# Altium project STM32_EVAL_BOARD.PrjPcb (part 1 of 2)
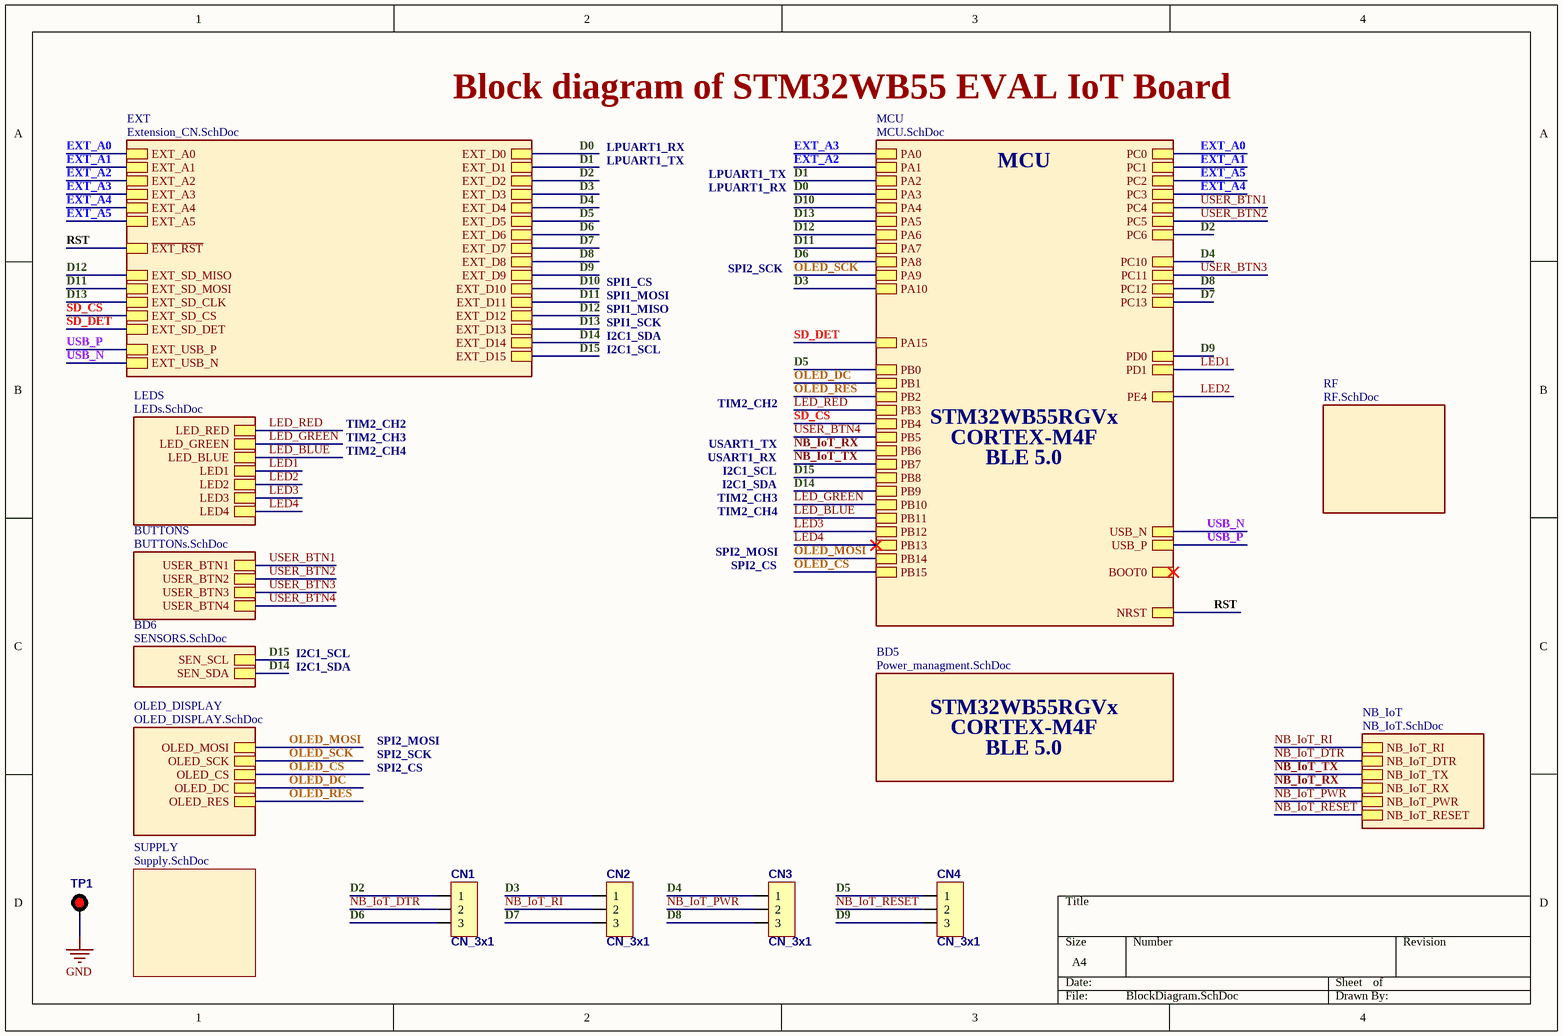
[diagram p0: BlockDiagram.SchDoc]
11 sheets, 201 parts. Net scope: hierarchical (ports join the sheet entries above them; power ports are global).
Board file: STM32WB_PCB.PcbDoc
Sheets:
  BlockDiagram.SchDoc
    EXT = Extension_CN.SchDoc
    MCU = MCU.SchDoc
    BUTTONS = BUTTONs.SchDoc
    BD5 = Power_managment.SchDoc
    NB_IoT = NB_IoT.SchDoc
    RF = RF.SchDoc
    LEDS = LEDs.SchDoc
    BD6 = SENSORS.SchDoc
    SUPPLY = Supply.SchDoc
    OLED_DISPLAY = OLED_DISPLAY.SchDoc

## Sheet BlockDiagram.SchDoc
size A4

### Parts
CN1  CN_3x1  [GP_3x1_2mm]
CN2  CN_3x1  [GP_3x1_2mm]
CN3  CN_3x1  [GP_3x1_2mm]
CN4  CN_3x1  [GP_3x1_2mm]
TP1  Keystone 5000 Test Point (RED)  [Keystone_5000_RED]  (value not drawn)

### Sub-sheets
BD5 = Power_managment.SchDoc: no entries
BD6 = SENSORS.SchDoc: SEN_SCL, SEN_SDA
BUTTONS = BUTTONs.SchDoc: USER_BTN2, USER_BTN3, USER_BTN1, USER_BTN4
EXT = Extension_CN.SchDoc: EXT_SD_CS, EXT_SD_MOSI, EXT_A5, EXT_A2, EXT_A4, EXT_A3, EXT_A1, EXT_A0, EXT_USB_P, EXT_SD_CLK, EXT_SD_MISO, EXT_SD_DET, EXT_USB_N, ~{EXT_RST}, EXT_D4, EXT_D3, EXT_D6, EXT_D0, EXT_D2, EXT_D5, EXT_D1, EXT_D7, EXT_D8, EXT_D10, EXT_D15, EXT_D12, EXT_D14, EXT_D13, EXT_D9, EXT_D11
LEDS = LEDs.SchDoc: LED_GREEN, LED2, LED_BLUE, LED1, LED_RED, LED3, LED4
MCU = MCU.SchDoc: PE4, PC4, PC0, PC3, USB_N, PC11, PC10, PC13, PC2, PC6, PC12, BOOT0, USB_P, PC5, PC1, NRST, PA10, PA9, PA8, PA7, PA6, PA5, PA3, PA1, PA2, PA0, PA4, PA15, PD0, PD1, PB0, PB1, PB15, PB14, PB13, PB12, PB11, PB9, PB8, PB7, PB6, PB5, PB2, PB4, PB10, PB3
NB_IoT = NB_IoT.SchDoc: NB_IoT_RI, NB_IoT_PWR, NB_IoT_RESET, NB_IoT_TX, NB_IoT_DTR, NB_IoT_RX
OLED_DISPLAY = OLED_DISPLAY.SchDoc: OLED_MOSI, OLED_SCK, OLED_CS, OLED_DC, OLED_RES
RF = RF.SchDoc: no entries
SUPPLY = Supply.SchDoc: no entries

### Nets
GND: TP1.0  [project net BS0]
D0: sheet EXT/EXT_D0, sheet MCU/PA3
D1: sheet EXT/EXT_D1, sheet MCU/PA2
D2: CN1.1 ; sheet EXT/EXT_D2, sheet MCU/PC6
D3: CN2.1 ; sheet EXT/EXT_D3, sheet MCU/PA10
D4: CN3.1 ; sheet EXT/EXT_D4, sheet MCU/PC10
D5: CN4.1 ; sheet EXT/EXT_D5, sheet MCU/PB0
D6: CN1.3 ; sheet EXT/EXT_D6, sheet MCU/PA8
D7: CN2.3 ; sheet EXT/EXT_D7, sheet MCU/PC13
D8: CN3.3 ; sheet EXT/EXT_D8, sheet MCU/PC12
D9: CN4.3 ; sheet EXT/EXT_D9, sheet MCU/PD0
D10: sheet EXT/EXT_D10, sheet MCU/PA4
D11: sheet EXT/EXT_SD_MOSI, sheet EXT/EXT_D11, sheet MCU/PA7
D12: sheet EXT/EXT_SD_MISO, sheet EXT/EXT_D12, sheet MCU/PA6
D13: sheet EXT/EXT_SD_CLK, sheet EXT/EXT_D13, sheet MCU/PA5
D14: sheet EXT/EXT_D14, sheet MCU/PB9, sheet BD6/SEN_SDA
D15: sheet EXT/EXT_D15, sheet MCU/PB8, sheet BD6/SEN_SCL
EXT_A0: sheet EXT/EXT_A0, sheet MCU/PC0  [project net A0]
EXT_A1: sheet EXT/EXT_A1, sheet MCU/PC1  [project net A1]
EXT_A2: sheet EXT/EXT_A2, sheet MCU/PA1  [project net A2]
EXT_A3: sheet EXT/EXT_A3, sheet MCU/PA0  [project net A3]
EXT_A4: sheet EXT/EXT_A4, sheet MCU/PC3
EXT_A5: sheet EXT/EXT_A5, sheet MCU/PC2
LED1: sheet MCU/PD1, sheet LEDS/LED1
LED2: sheet MCU/PE4, sheet LEDS/LED2
LED3: sheet MCU/PB12, sheet LEDS/LED3
LED4: sheet MCU/PB13, sheet LEDS/LED4
LED_BLUE: sheet MCU/PB11, sheet LEDS/LED_BLUE
LED_GREEN: sheet MCU/PB10, sheet LEDS/LED_GREEN
LED_RED: sheet MCU/PB3, sheet LEDS/LED_RED
NB_IoT_DTR: CN1.2 ; sheet NB_IoT/NB_IoT_DTR
NB_IoT_PWR: CN3.2 ; sheet NB_IoT/NB_IoT_PWR
NB_IoT_RESET: CN4.2 ; sheet NB_IoT/NB_IoT_RESET
NB_IoT_RI: CN2.2 ; sheet NB_IoT/NB_IoT_RI
NB_IoT_RX: sheet MCU/PB6, sheet NB_IoT/NB_IoT_RX
NB_IoT_TX: sheet MCU/PB7, sheet NB_IoT/NB_IoT_TX
OLED_CS: sheet MCU/PB15, sheet OLED_DISPLAY/OLED_CS  [project net CS]
OLED_DC: sheet MCU/PB1, sheet OLED_DISPLAY/OLED_DC  [project net D/C]
OLED_MOSI: sheet MCU/PB14, sheet OLED_DISPLAY/OLED_MOSI  [project net DIN]
OLED_RES: sheet MCU/PB2, sheet OLED_DISPLAY/OLED_RES
OLED_SCK: sheet MCU/PA9, sheet OLED_DISPLAY/OLED_SCK  [project net CLK]
RST: sheet EXT/~{EXT_RST}, sheet MCU/NRST
SD_CS: sheet EXT/EXT_SD_CS, sheet MCU/PB4
SD_DET: sheet EXT/EXT_SD_DET, sheet MCU/PA15
USB_N: sheet EXT/EXT_USB_N, sheet MCU/USB_N
USB_P: sheet EXT/EXT_USB_P, sheet MCU/USB_P
USER_BTN1: sheet MCU/PC4, sheet BUTTONS/USER_BTN1
USER_BTN2: sheet MCU/PC5, sheet BUTTONS/USER_BTN2
USER_BTN3: sheet MCU/PC11, sheet BUTTONS/USER_BTN3
USER_BTN4: sheet MCU/PB5, sheet BUTTONS/USER_BTN4

### Notes on the sheet
- Block diagram of STM32WB55 EVAL IoT Board
- LPUART1_RX
- LPUART1_TX
- MCU
- SPI1_MISO
- SPI1_MOSI
- SPI1_CS
- SPI2_SCK
- SPI1_SCK
- I2C1_SDA
- I2C1_SCL
- TIM2_CH4
- TIM2_CH3
- TIM2_CH2
- USART1_TX
- STM32WB55RGVx
- CORTEX-M4F
- USART1_RX
- BLE 5.0
- SPI2_MOSI
- SPI2_CS

### Library data of the parts
TP1 = Keystone 5000 Test Point

## Sheet Extension_CN.SchDoc: Arduino/Morphos extension connectors
size A4; Author: Ph.A; SheetNumber: 4; SheetTotal: 6
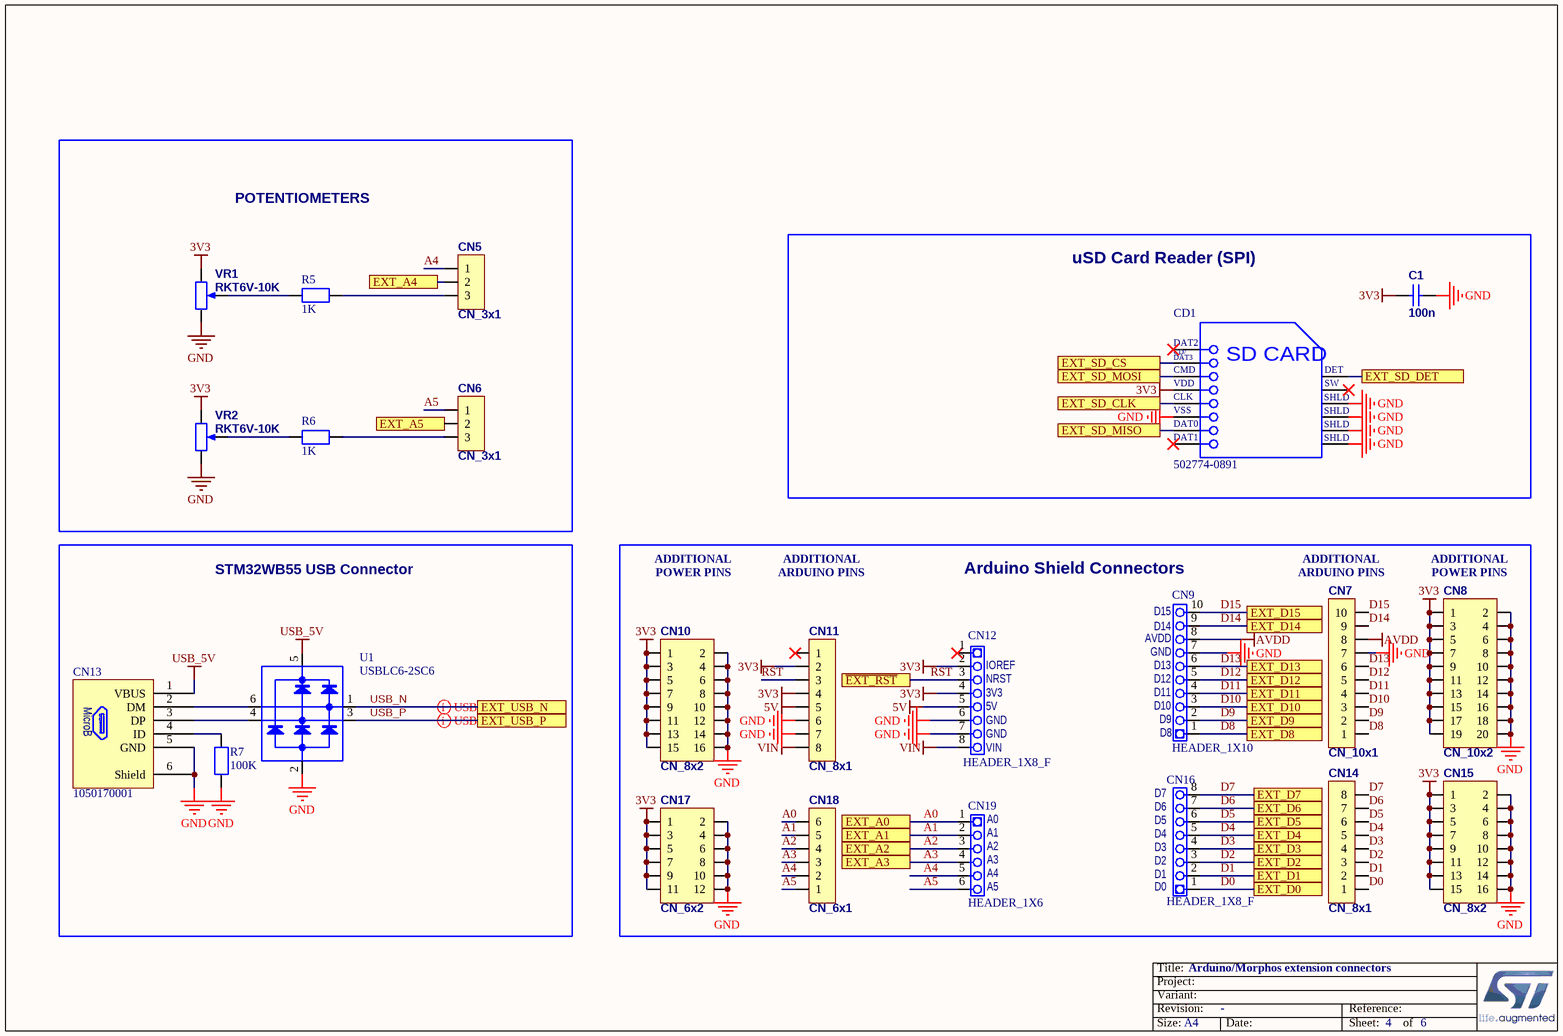
[diagram p1: Extension_CN.SchDoc]

### Parts
C1  100n  [0603_CAP_NPOL]
CD1  502774-0891  [MOLX-502774-0891_V]
CN5  CN_3x1  [GP_3x1_2mm]
CN6  CN_3x1  [GP_3x1_2mm]
CN7  CN_10x1  [GP_10x1]
CN8  CN_10x2  [GP_10x2]
CN9  HEADER_1X10  [Header F 1x10x2.54 TH V]
CN10  CN_8x2  [GP_8x2]
CN11  CN_8x1  [GP_8x1]
CN12  HEADER_1X8_F  [Header F 1x8x2.54 TH V]
CN13  1050170001  [USBMICROB_MOLEX_105017-0001_H2P90]
CN14  CN_8x1  [GP_8x1]
CN15  CN_8x2  [GP_8x2]
CN16  HEADER_1X8_F  [Header F 1x8x2.54 TH V]
CN17  CN_6x2  [GP_6x2]
CN18  CN_6x1  [GP_6x1]
CN19  HEADER_1X6  [Header F 1x6x2.54 TH V]
R5  1K  [0402_RES]
R6  1K  [0402_RES]
R7  100K  [0402_RES]
U1  USBLC6-2SC6  [SOT23-6]
VR1  RKT6V-10K  [PT6LV_2]
VR2  RKT6V-10K  [PT6LV_2]

### Blocks framed on the sheet
POTENTIOMETERS: CN5 CN6 R5 R6 VR1 VR2
uSD Card Reader (SPI): C1 CD1
STM32WB55 USB Connector: CN13 R7 U1
Arduino Shield Connectors: CN7-CN12 CN14-CN19

### Ports
EXT_A0, EXT_A1, EXT_A2, EXT_A3, EXT_A4, EXT_A5, EXT_D0, EXT_D1, EXT_D2, EXT_D3, EXT_D4, EXT_D5, EXT_D6, EXT_D7, EXT_D8, EXT_D9, EXT_D10, EXT_D11, EXT_D12, EXT_D13, EXT_D14, EXT_D15, EXT_SD_CLK, EXT_SD_CS, EXT_SD_DET, EXT_SD_MISO, EXT_SD_MOSI, EXT_USB_N, EXT_USB_P, ~{EXT_RST}

### Nets
3V3: C1.1 CD1.4(VDD) CN8.1 CN8.3 CN8.5 CN8.7 CN8.9 CN8.11 CN8.13 CN8.15 CN8.17 CN8.19 CN10.1 CN10.3 CN10.5 CN10.7 CN10.9 CN10.11 CN10.13 CN10.15 CN11.2 CN11.4 CN12.2 CN12.4 CN15.1 CN15.3 CN15.5 CN15.7 CN15.9 CN15.11 CN15.13 CN15.15 CN17.1 CN17.3 CN17.5 CN17.7 CN17.9 CN17.11 VR1.2(BOT) VR2.2(BOT)
5V: CN11.5 CN12.5
AVDD: CN7.8 CN9.8
GND: C1.2 CD1.6(VSS) CD1.11(SHLD) CD1.12(SHLD) CD1.13(SHLD) CD1.14(SHLD) CN7.7 CN8.2 CN8.4 CN8.6 CN8.8 CN8.10 CN8.12 CN8.14 CN8.16 CN8.18 CN8.20 CN9.7 CN10.2 CN10.4 CN10.6 CN10.8 CN10.10 CN10.12 CN10.14 CN10.16 CN11.6 CN11.7 CN12.6 CN12.7 CN13.5(GND) CN13.6(Shield) CN15.2 CN15.4 CN15.6 CN15.8 CN15.10 CN15.12 CN15.14 CN15.16 CN17.2 CN17.4 CN17.6 CN17.8 CN17.10 CN17.12 R7.1 U1.2 VR1.1(TOP) VR2.1(TOP)  [project net BS0]
USB_5V: CN13.1(VBUS) U1.5
VIN: CN11.8 CN12.8
A0: CN18.6 CN19.1 ; port EXT_A0
A1: CN18.5 CN19.2 ; port EXT_A1
A2: CN18.4 CN19.3 ; port EXT_A2
A3: CN18.3 CN19.4 ; port EXT_A3
A4: CN5.1 CN18.2 CN19.5
A5: CN6.1 CN18.1 CN19.6
D0: CN14.1 CN16.1 ; port EXT_D0
D1: CN14.2 CN16.2 ; port EXT_D1
D2: CN14.3 CN16.3 ; port EXT_D2
D3: CN14.4 CN16.4 ; port EXT_D3
D4: CN14.5 CN16.5 ; port EXT_D4
D5: CN14.6 CN16.6 ; port EXT_D5
D6: CN14.7 CN16.7 ; port EXT_D6
D7: CN14.8 CN16.8 ; port EXT_D7
D8: CN7.1 CN9.1 ; port EXT_D8
D9: CN7.2 CN9.2 ; port EXT_D9
D10: CN7.3 CN9.3 ; port EXT_D10
D11: CD1.3(CMD) CN7.4 CN9.4 ; port EXT_D11, port EXT_SD_MOSI
D12: CD1.7(DAT0) CN7.5 CN9.5 ; port EXT_D12, port EXT_SD_MISO
D13: CD1.5(CLK) CN7.6 CN9.6 ; port EXT_D13, port EXT_SD_CLK
D14: CN7.9 CN9.9 ; port EXT_D14
D15: CN7.10 CN9.10 ; port EXT_D15
EXT_A4: CN5.2 ; port EXT_A4
EXT_A5: CN6.2 ; port EXT_A5
RST: CN11.3 CN12.3 ; port ~{EXT_RST}
SD_CS: CD1.2(CD/DAT3) ; port EXT_SD_CS
SD_DET: CD1.9(DETECT) ; port EXT_SD_DET
USB_N: U1.1 ; port EXT_USB_N
USB_P: U1.3 ; port EXT_USB_P
NetCN5_3: CN5.3 R5.2
NetCN6_3: CN6.3 R6.2
NetCN13_2: CN13.2(DM) U1.6
NetCN13_3: CN13.3(DP) U1.4
NetCN13_4: CN13.4(ID) R7.2
NetR5_1: R5.1 VR1.3(TAP)
NetR6_1: R6.1 VR2.3(TAP)

Not connected (* = marked no-connect by the designer): CD1 1(DAT2)* 8(DAT1)* 10(SWITCH)*; CN11 1*; CN12 1*

### Layout directives
differential pair; net class DIFF90: USB_N, USB_P

### Notes on the sheet
- ADDITIONAL
- POWER PINS
- ARDUINO PINS
- (near CN7) ADDITIONAL
- (near CN7) ARDUINO PINS
- (near CN8) ADDITIONAL
- (near CN8) POWER PINS
- (near CN9) AVDD
- (near CN9) GND
- (near CN9) D14
- (near CN9) D15
- (near CN12) 5V
- (near CN12) 3V3
- (near CN12) NRST
- (near CN12) IOREF
- (near CN9) D10
- (near CN9) D11
- (near CN9) D12
- (near CN9) D13
- (near CN12) GND
- (near CN12) VIN
- (near CN9) D9
- (near CN9) D8
- (near CN19) A0
- (near CN19) A1
- (near CN19) A2
- (near CN16) D3
- (near CN16) D4
- (near CN16) D5
- (near CN16) D6
- (near CN16) D7
- (near CN19) A5
- (near CN19) A3
- (near CN19) A4
- (near CN16) D0
- (near CN16) D1
- (near CN16) D2
- Title:
- Project:
- Size:
- Revision:
- Variant:
- -
- Date:
- Reference:
- Sheet:
- of
- (in symbol 1050170001) MicroB
- (in symbol CMP-2000-05248-1) CD/; DAT3; SD CARD; DET; SW

### Library data of the parts
C1 = Cap: Capacitor; ComponentLink1Description: datasheet; ComponentLink2Description: supplier; Value: 100n
CD1 = CMP-2000-05248-1: Micro SD Memory Card Connector, 0.5 A, 10 V (DC), -25 to 85 degC, 8-Pin SMT, RoHS, Tape and Reel; Manufacturer: Molex; 3D Model: 502774-0891.stp; Online Catalog: microSD™Series; Number of Positions: 10(8+2); Card Type: SecureDigital-microSD™; Insertion, Removal Method: PushIn,PushOut; Other Names: WM24066DKR; Connector Type: ConnectorandEjector; Features: Switch; Family: MemoryConnectors-PCCardSockets; Manufacturer URL: http://www.molex.com/; Mounting Type: SurfaceMount,RightAngle; Contact Finish Thickness: 20µin(0.51µm); Standard Package: 1; Series: 502774; Ejector Side: -; Datasheet Version: Rev. D, 04/2004; Category: Connectors,Interconnects; Contact Finish: Gold; Datasheet URL: https://datasheet.ciiva.com/1104/1499551-1104671.pdf; RoHS Information: 502774-0891CertofCompliance; Mounting Feature: Reverse-Bottom; Packaging: Digi-Reel; Height Above Board: 0.071"(1.80mm); Catalog Drawings: 502774-0891
CN12 = HEADER_1X8: Specific Function: Arduino Power
CN13 = 1050170001: USB-MICRO-B, 1050170001, SMT, MOLEX; Fitted: YES; Ordered_By: Subcon; ECCN_US/EU: n/a; Manuf_1: MOLEX; Manuf_Part_1: 1050170001; Distrib: DIGIKEY; Value: 1050170001; Order_Code: *
CN16 = HEADER_1X8: Specific Function: Arduino Digital 1
R5-R7 = RES: Resistor
U1 = USBLC6-2
VR1 VR2 = RKT6V-10K: Potentiometer: mounting; single turn, horizontal; 10kΩ; 100mW; Published: 21-10-2009; ComponentLink1Description: datasheet; ComponentLink2Description: supplier; Supplier 1: TME; Supplier Part Number 1: RKT6V-10K

## Sheet MCU.SchDoc: STM32WB55RG microcontroller I/Os
size A4; Author: Ph.A; SheetNumber: 2; SheetTotal: 6
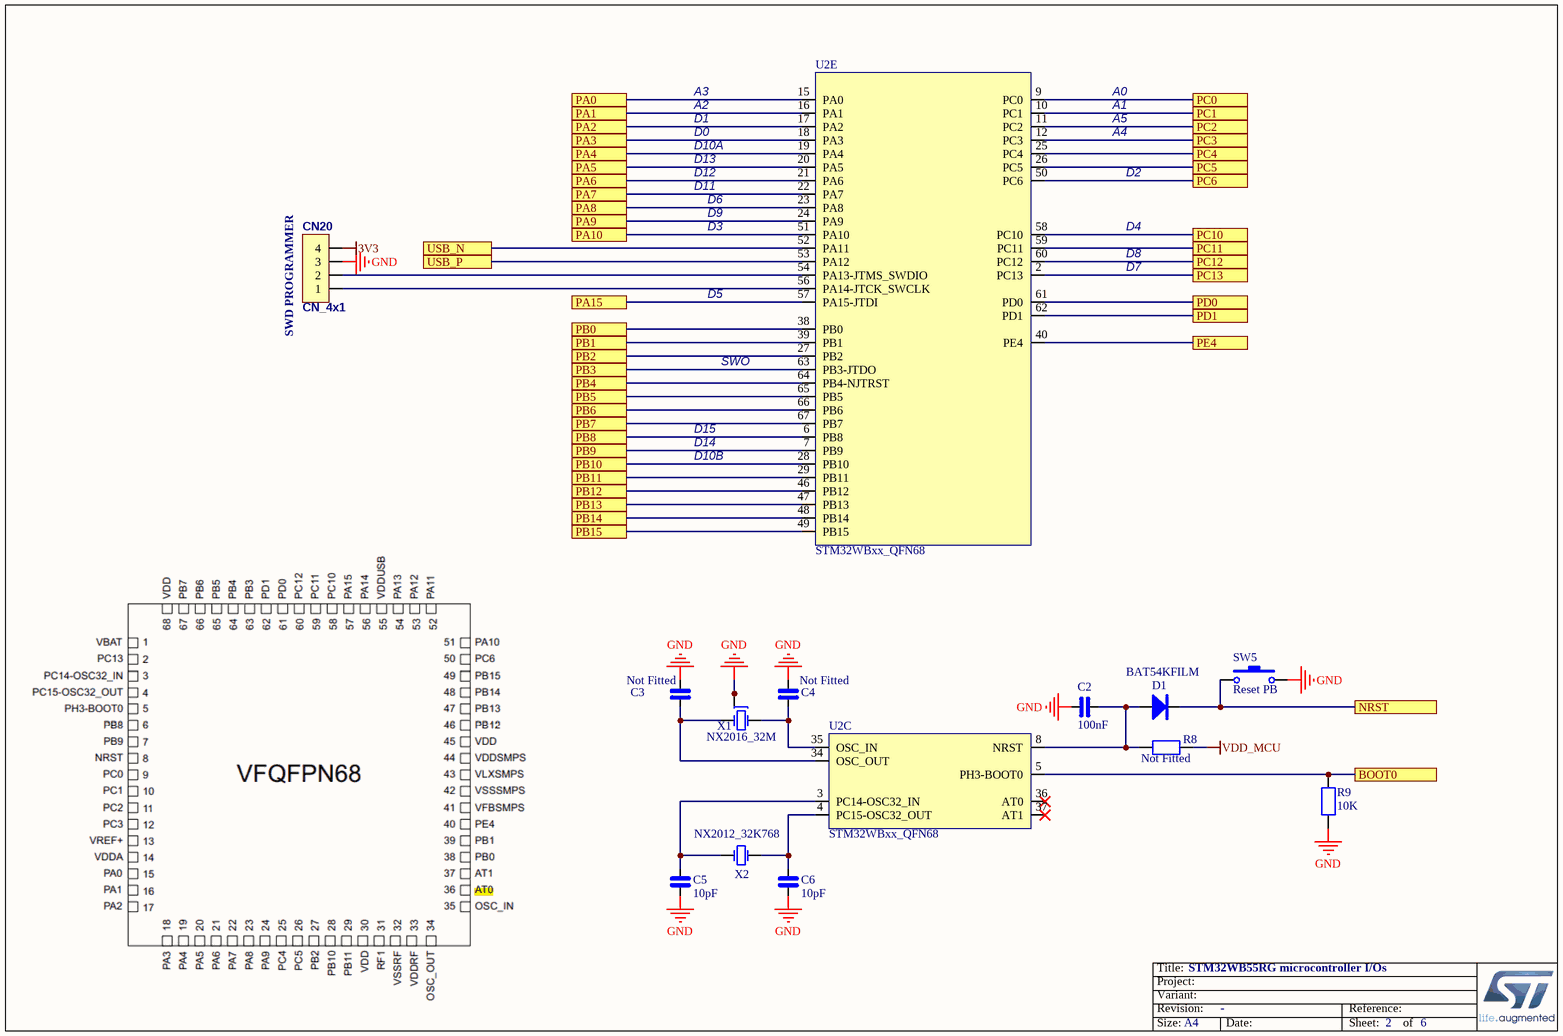
[diagram p2: MCU.SchDoc]

### Parts
C2  100nF  [0603_CAP_NPOL]
C3  Fitted: Not Fitted  [0603_CAP_NPOL]  (hidden comment: TBD)
C4  Fitted: Not Fitted  [0603_CAP_NPOL]  (hidden comment: TBD)
C5  10pF  [0603_CAP_NPOL]
C6  10pF  [0603_CAP_NPOL]
CN20  CN_4x1  [GP_4x1]
D1  BAT54KFILM  [SOD523]
R8  Fitted: Not Fitted  [0402_RES]  (hidden comment: 100K (not fitted))
R9  10K  [0402_RES]
SW5  Reset PB  [SW-PB SMD KMR2]
U2  STM32WBxx_QFN68  [VFQFPN68_8x8x0.1_p0.4]  (parts C,E of 5)
X1  NX2016_32M  [NX2016_4P]
X2  NX2012_32K768  [NX2012_2P]

### Ports
BOOT0, NRST, PA0, PA1, PA2, PA3, PA4, PA5, PA6, PA7, PA8, PA9, PA10, PA15, PB0, PB1, PB2, PB3, PB4, PB5, PB6, PB7, PB8, PB9, PB10, PB11, PB12, PB13, PB14, PB15, PC0, PC1, PC2, PC3, PC4, PC5, PC6, PC10, PC11, PC12, PC13, PD0, PD1, PE4, USB_N, USB_P

### Nets
3V3: CN20.4
GND: C2.1 C3.2 C4.2 C5.2 C6.2 CN20.3 R9.2 SW5.2 X1.2 X1.4  [project net BS0]
VDD_MCU: R8.1
A0: U2.9(PC0) ; port PC0
A1: U2.10(PC1) ; port PC1
A2: U2.16(PA1) ; port PA1
A3: U2.15(PA0) ; port PA0
CLK: U2.24(PA9) ; port PA9
CS: U2.49(PB15) ; port PB15
D0: U2.18(PA3) ; port PA3
D1: U2.17(PA2) ; port PA2
D2: U2.50(PC6) ; port PC6
D3: U2.51(PA10) ; port PA10
D4: U2.58(PC10) ; port PC10
D5: U2.38(PB0) ; port PB0
D6: U2.23(PA8) ; port PA8
D7: U2.2(PC13) ; port PC13
D8: U2.60(PC12) ; port PC12
D9: U2.61(PD0) ; port PD0
D10: U2.19(PA4) ; port PA4
D11: U2.22(PA7) ; port PA7
D12: U2.21(PA6) ; port PA6
D13: U2.20(PA5) ; port PA5
D14: U2.7(PB9) ; port PB9
D15: U2.6(PB8) ; port PB8
D/C: U2.39(PB1) ; port PB1
DIN: U2.48(PB14) ; port PB14
EXT_A4: U2.12(PC3) ; port PC3
EXT_A5: U2.11(PC2) ; port PC2
LED1: U2.62(PD1) ; port PD1
LED2: U2.40(PE4) ; port PE4
LED3: U2.46(PB12) ; port PB12
LED4: U2.47(PB13) ; port PB13
LED_BLUE: U2.29(PB11) ; port PB11
LED_GREEN: U2.28(PB10) ; port PB10
LED_RED: U2.63(PB3-JTDO) ; port PB3
NB_IoT_RX: U2.66(PB6) ; port PB6
NB_IoT_TX: U2.67(PB7) ; port PB7
OLED_RES: U2.27(PB2) ; port PB2
RST: D1.K SW5.1 ; port NRST
SD_CS: U2.64(PB4-NJTRST) ; port PB4
SD_DET: U2.57(PA15-JTDI) ; port PA15
USB_N: U2.52(PA11) ; port USB_N
USB_P: U2.53(PA12) ; port USB_P
USER_BTN1: U2.25(PC4) ; port PC4
USER_BTN2: U2.26(PC5) ; port PC5
USER_BTN3: U2.59(PC11) ; port PC11
USER_BTN4: U2.65(PB5) ; port PB5
NetC2_2: C2.2 D1.A R8.2 U2.8(NRST)
NetC3_1: C3.1 U2.34(OSC_OUT) X1.3(OSC2)
NetC4_1: C4.1 U2.35(OSC_IN) X1.1(OSC1)
NetC5_1: C5.1 U2.3(PC14-OSC32_IN) X2.1(OSC1)
NetC6_1: C6.1 U2.4(PC15-OSC32_OUT) X2.2(OSC2)
NetCN20_1: CN20.1 U2.56(PA14-JTCK_SWCLK)
NetCN20_2: CN20.2 U2.54(PA13-JTMS_SWDIO)
NetR9_1: R9.1 U2.5(PH3-BOOT0) ; port BOOT0

Not connected (* = marked no-connect by the designer): U2 36(AT0)* 37(AT1)*

### Notes on the sheet
- A2
- A3
- A0
- A1
- D12
- D13
- D0
- D1
- D10A
- A4
- A5
- D2
- D11
- D9
- D3
- D6
- D4
- (near CN20) SWD PROGRAMMER
- D5
- D7
- D8
- SWO
- D14
- D15
- D10B
- Title:
- Project:
- Size:
- Revision:
- Variant:
- -
- Date:
- Reference:
- Sheet:
- of

### Library data of the parts
C2-C6 = CAP_NPOL: Capacitor_not polarized
D1 = BAT54K: Schottky Diode
R8 R9 = RES: Resistor
SW5 = SW-PB_1: Push-button SMD; Order code RS: 102-412
X1 = NX2016_32M: Crystal NDK 2.0x1.6mm  32 MHz; Manufacturer P/N: NX2016SA 32 MHz EXS00A-CS06654; Ref: NX2016SA 32MHz  EXS00A-CS06654  Référence interne NDK : X5087283; Manufacturer: NDK
X2 = NX2012_32K768: Crystal NDK 2.0x1.2mm  32.768 KHz; Manufacturer P/N: NX2012SA 32.768KHz  EXS00A-MU00389; Ref: NX2012SA 32.768KHz  EXS00A-MU00389  Référence interne NDK : X3037088; Manufacturer: NDK

## Sheet BUTTONs.SchDoc
size A4
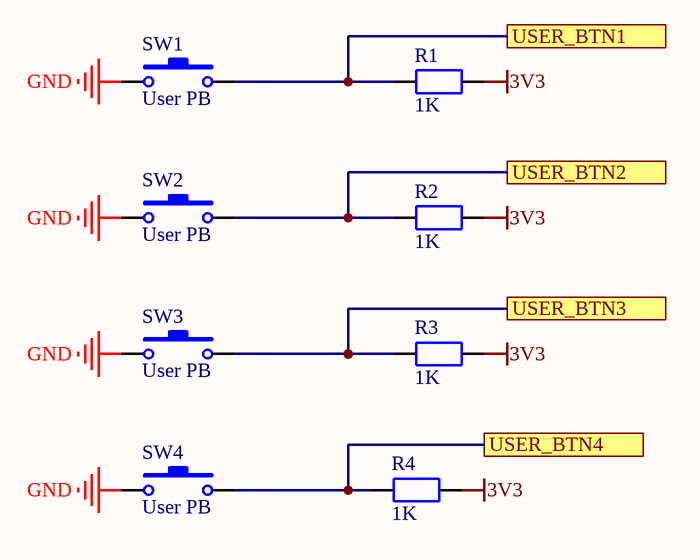
[diagram p3: BUTTONs.SchDoc]

### Parts
R1  1K  [0402_RES]
R2  1K  [0402_RES]
R3  1K  [0402_RES]
R4  1K  [0402_RES]
SW1  User PB  [SW-PB SMD KMR2]
SW2  User PB  [SW-PB SMD KMR2]
SW3  User PB  [SW-PB SMD KMR2]
SW4  User PB  [SW-PB SMD KMR2]

### Ports
USER_BTN1, USER_BTN2, USER_BTN3, USER_BTN4

### Nets
3V3: R1.2 R2.2 R3.2 R4.2
GND: SW1.1 SW2.1 SW3.1 SW4.1  [project net BS0]
USER_BTN1: R1.1 SW1.2 ; port USER_BTN1
USER_BTN2: R2.1 SW2.2 ; port USER_BTN2
USER_BTN3: R3.1 SW3.2 ; port USER_BTN3
USER_BTN4: R4.1 SW4.2 ; port USER_BTN4

### Library data of the parts
R1-R4 = RES: Resistor
SW1-SW4 = SW-PB_1: Push-button SMD; Order code RS: 102-412

## Sheet Power_managment.SchDoc: Power Management
size A4; Author: Ph.A; SheetNumber: 5; SheetTotal: 6
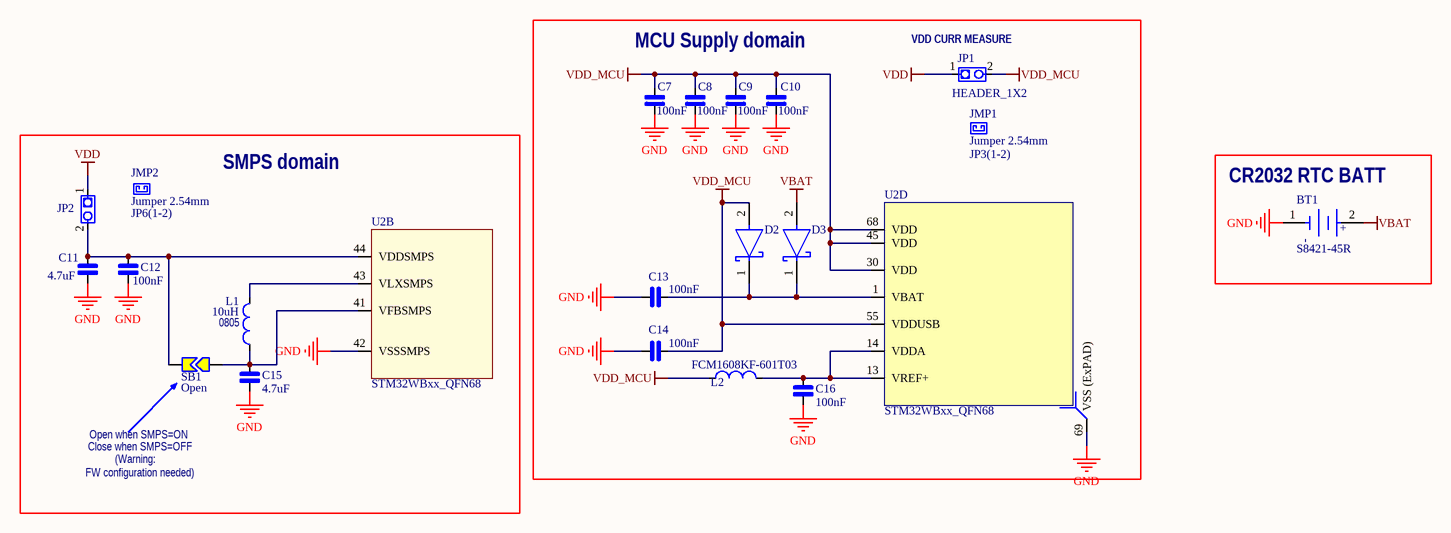
[diagram p4: Power_managment.SchDoc]

### Parts
BT1  S8421-45R  [FP-S8421-45R-MFG]
C7  100nF  [C1206]
C8  100nF  [C1206]
C9  100nF  [C1206]
C10  100nF  [C1206]
C11  4.7uF  [C1206]
C12  100nF  [C1206]
C13  100nF  [C1206]
C14  100nF  [C1206]
C15  4.7uF  [C1206]
C16  100nF  [C1206]
D2  LS4148-GS18  [FP-6_560-5006_01-4-MFG]  (value not drawn)
D3  LS4148-GS18  [FP-6_560-5006_01-4-MFG]  (value not drawn)
JMP1  Jumper 2.54mm  default: JP3(1-2)  [Jumper 2.54mm BLACK]
JMP2  Jumper 2.54mm  default: JP6(1-2)  [Jumper 2.54mm BLACK]
JP1  HEADER_1X2  [Header M 1x2x2.54 TH V]
JP2  HEADER_1X2  [GP_2x1_2mm]  (value not drawn)
L1  10uH  [0805_COIL]
L2  FCM1608KF-601T03  [0603_COIL]
SB1  Open  [SB-tiny]
U2  STM32WBxx_QFN68  [VFQFPN68_8x8x0.1_p0.4]  (parts B,D of 5)

### Blocks framed on the sheet
MCU Supply domain: C7-C10 C13 C14 C16 D2 D3 JMP1 JP1 L2 U2
SMPS domain: C11 C12 C15 JMP2 JP2 L1 SB1 U2
CR2032 RTC BATT: BT1

### Nets
GND: BT1.1(C) C7.2 C8.2 C9.2 C10.2 C11.2 C12.2 C13.2 C14.2 C15.2 C16.2 U2.42(VSSSMPS) U2.69(VSS_(ExPAD))  [project net BS0]
VBAT: BT1.2(A) D3.2(A)
VDD: JP1.1 JP2.1  [project net 3V3]
VDD_MCU: C7.1 C8.1 C9.1 C10.1 C14.1 D2.2(A) JP1.2 L2.1 U2.30(VDD) U2.45(VDD) U2.55(VDDUSB) U2.68(VDD)
NetC11_1: C11.1 C12.1 JP2.2 SB1.2 U2.44(VDDSMPS)
NetC13_1: C13.1 D2.1(C) D3.1(C) U2.1(VBAT)
NetC15_1: C15.1 L1.1 SB1.1 U2.41(VFBSMPS)
NetC16_1: C16.1 L2.2 U2.13(VREF+) U2.14(VDDA)
NetL1_2: L1.2 U2.43(VLXSMPS)

### Notes on the sheet
- (near JP1) VDD CURR MEASURE
- (near L1) 0805
- FW configuration needed)
- Close when SMPS=OFF
- Open when SMPS=ON
- (Warning:
- Title:
- Project:
- Size:
- Revision:
- Variant:
- A4
- -
- Date:
- Reference:
- Sheet:
- of
- (in symbol CMP-2000-07028-3) +; -

### Library data of the parts
BT1 = CMP-2000-07028-3: BATTERY HOLDER COIN 20MM SMD; Number of Cells: 1; Min Operating Temperature: -40°C; Packaging: Tape and Reel; Max Operating Temperature: 105°C; Number of Batteries: 1; Package Quantity: 500; Material: Polyphenylene; Case/Package: SMD/SMT; Mount: Surface Mount; REACH SVHC: No SVHC; Contact Plating: Bronze; Termination: SMD/SMT
C7-C16 = CAP_NPOL: Capacitor_not polarized
D2 D3 = CMP-02539-000014-1: DIODE GEN PURP 75V 150MA SOD80; Manufacturer: Vishay; Capacitance: 4pF; Max Surge Forward Current: 2A; Forward Current: 300mA; Max Repetitive Reverse Voltage: 100V; Max Junction Temp: +175°C; Peak Reverse Current: 5uA; Value: 4pF; Automotive Grade: Grade 0; Device Class L2: Diodes; Digikey Description: DIODE GEN PURP 75V 150MA SOD80; Lead Free: Yes; Device Class L1: Discrete Semiconductors; Mouser Description: In a Pack of 100, Vishay Switching Diode, 300mA 75V, 2-Pin SOD-80 LS4148-GS18; Package: 6.560-5006.01-4; RoHS: TRUE; Temperature Range High: +175°C; ComponentLink2URL: http://www.vishay.com/docs/85561/ls4148.pdf; Temperature: to +175°C; Manufacturer Part Number: LS4148-GS18; Device Class L3: Schottky Diodes; Automotive: Yes; ComponentLink2Description: Datasheet; Reverse Voltage: 75V; Height: 1.7mm; Category: Diode; Octopart: https://octopart.com/ls4148-gs18-vishay-55507867
JP1 JP2 = HEADER_1X2_L
L1 = IND_74479777310A: Coil Wurtz 10uH ref: 74479777310A
L2 = IND_FCM1608KF-601T03
SB1 = Strap2: Solder Jumper; Solder: YES; Published: 24-Mar-1999; Revision: July-2002: Re-released for DXP Platform.; Publisher: Altium Limited

## Sheet NB_IoT.SchDoc
size A4
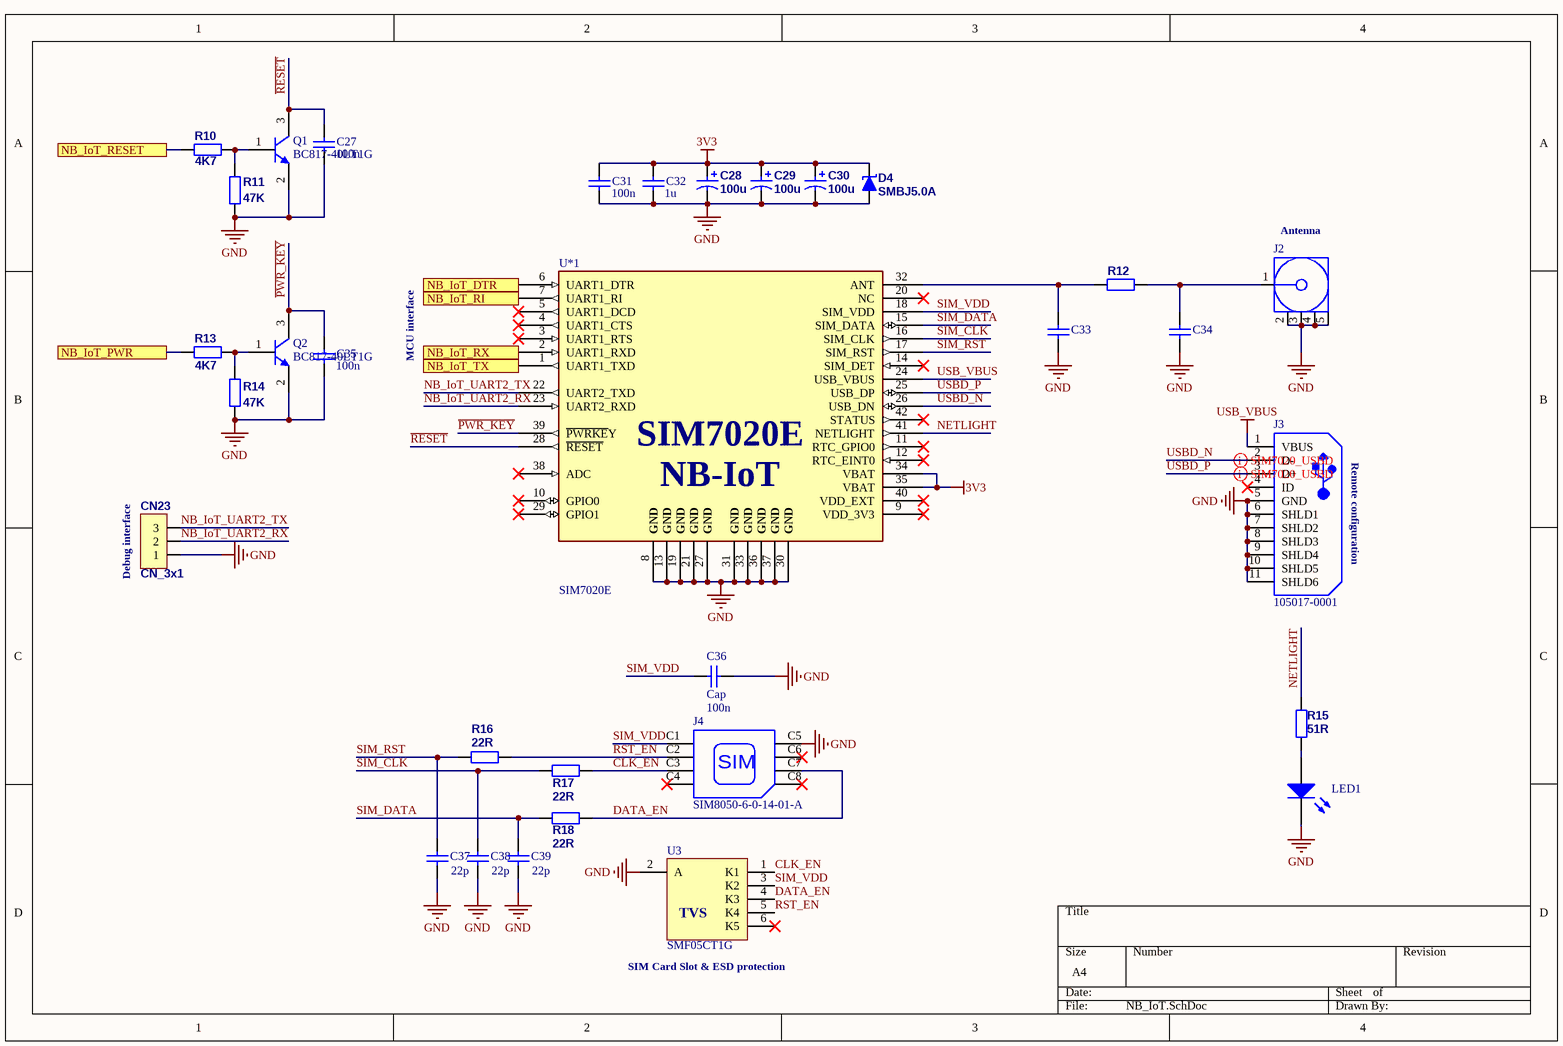
[diagram p5: NB_IoT.SchDoc]

### Parts
C27  value 100n  [0603_CAP_NPOL]  (hidden comment: Cap)
C28  100u  [0603_CAP_NPOL]
C29  100u  [0603_CAP_NPOL]
C30  100u  [0603_CAP_NPOL]
C31  value 100n  [0603_CAP_NPOL]  (hidden comment: Cap)
C32  value 1u  [0603_CAP_NPOL]  (hidden comment: Cap)
C33  ap  [0603_CAP_NPOL]  (value not drawn)
C34  ap  [0603_CAP_NPOL]  (value not drawn)
C35  value 100n  [0603_CAP_NPOL]  (hidden comment: Cap)
C36  Cap  value 100n  [0603_CAP_NPOL]
C37  value 22p  [0603_CAP_NPOL]  (hidden comment: Cap)
C38  value 22p  [0603_CAP_NPOL]  (hidden comment: Cap)
C39  value 22p  [0603_CAP_NPOL]  (hidden comment: Cap)
CN23  CN_3x1  [GP_3x1_2mm]
D4  SMBJ5.0A  [SMB]
J2  731000114  [MOLX-731000114_V]  (value not drawn)
J3  105017-0001  [USB-MICRO-B_V]
J4  SIM8050-6-0-14-01-A  [GCT-SIM8050-6_V]
LED1  150080RS75000  [0805_A]  (value not drawn)
Q1  BC817-40LT1G  [ONSC-SOT-23-3-318-08_V]
Q2  BC817-40LT1G  [ONSC-SOT-23-3-318-08_V]
R10  4K7  [0402_RES]
R11  47K  [0402_RES]
R12  (no value)  [0402_RES]
R13  4K7  [0402_RES]
R14  47K  [0402_RES]
R15  51R  [0402_RES]
R16  22R  [0402_RES]
R17  22R  [0402_RES]
R18  22R  [0402_RES]
U3  SMF05CT1G  [ONSC-SC70-6-419B-02_W_V]
U*1  SIM7020E  [LCC_42PIN]

### Ports
NB_IoT_DTR, NB_IoT_PWR, NB_IoT_RESET, NB_IoT_RI, NB_IoT_RX, NB_IoT_TX

### Nets
3V3: C28.1 C29.1 C30.1 C31.2 C32.2 D4.2(K) U*1.34(VBAT) U*1.35(VBAT)
GND: C27.1 C28.2 C29.2 C30.2 C31.1 C32.1 C33.1 C34.1 C35.1 C36.2 C37.1 C38.1 C39.1 CN23.1 D4.1(A) J2.2 J2.3 J2.4 J2.5 J3.5(GND) J3.6(SHLD1) J3.7(SHLD2) J3.8(SHLD3) J3.9(SHLD4) J3.10(SHLD5) J3.11(SHLD6) J4.C5(GND) LED1.1(K) Q1.2(E) Q2.2(E) R11.1 R14.1 U3.2(A) U*1.8(GND) U*1.13(GND) U*1.19(GND) U*1.21(GND) U*1.27(GND) U*1.30(GND) U*1.31(GND) U*1.33(GND) U*1.36(GND) U*1.37(GND)  [project net BS0]
USB_VBUS: J3.1(VBUS) U*1.24(USB_VBUS)
~{PWR_KEY}: C35.2 Q2.3(C) U*1.39(~{PWRKE}Y)
~{RESET}: C27.2 Q1.3(C) U*1.28(~{RESET})
CLK_EN: J4.C3(CLK) R17.2 U3.1(K1)
DATA_EN: J4.C7(I/O) R18.2 U3.4(K3)
NB_IoT_DTR: U*1.6(UART1_DTR) ; port NB_IoT_DTR
NB_IoT_PWR: R13.1 ; port NB_IoT_PWR
NB_IoT_RESET: R10.1 ; port NB_IoT_RESET
NB_IoT_RI: U*1.7(UART1_RI) ; port NB_IoT_RI
NB_IoT_RX: U*1.2(UART1_RXD) ; port NB_IoT_RX
NB_IoT_TX: U*1.1(UART1_TXD) ; port NB_IoT_TX
NB_IoT_UART2_RX: CN23.2 U*1.23(UART2_RXD)
NB_IoT_UART2_TX: CN23.3 U*1.22(UART2_TXD)
NETLIGHT: R15.2 U*1.41(NETLIGHT)
RST_EN: J4.C2(RST) R16.2 U3.5(K4)
SIM_CLK: C38.2 R17.1 U*1.16(SIM_CLK)
SIM_DATA: C39.2 R18.1 U*1.15(SIM_DATA)
SIM_RST: C37.2 R16.1 U*1.17(SIM_RST)
SIM_VDD: C36.1 J4.C1(VCC) U3.3(K2) U*1.18(SIM_VDD)
USBD_N: J3.2(D-) U*1.26(USB_DN)
USBD_P: J3.3(D+) U*1.25(USB_DP)
NetC33_2: C33.2 R12.1 U*1.32(ANT)
NetC34_2: C34.2 J2.1 R12.2
NetLED1_2: LED1.2(A) R15.1
NetQ1_1: Q1.1(B) R10.2 R11.2
NetQ2_1: Q2.1(B) R13.2 R14.2

Not connected (* = marked no-connect by the designer): J3 4(ID)*; J4 C4(SHLD)* C6(VPP)* C8(SHLD)*; U3 6(K5)*; U*1 3(UART1_RTS)* 4(UART1_CTS)* 5(UART1_DCD)* 9(VDD_3V3)* 10(GPIO0)* 11(RTC_GPIO0)* 12(RTC_EINT0)* 14(SIM_DET)* 20(NC)* 29(GPIO1)* 38(ADC)* 40(VDD_EXT)* 42(STATUS)*

### Layout directives
differential pair: USBD_N, USBD_P

### Notes on the sheet
- (near J2) Antenna
- MCU interface
- Remote configuration
- (near CN23) Debug interface
- (near U3) TVS
- (near U3) SIM Card Slot & ESD protection
- (in symbol CMP-2000-07068-1) SIM
- (in symbol SIM7020E) NB-IoT

### Library data of the parts
C27 C31-C39 = Cap: Capacitor; Published: 8-Jun-2000; LatestRevisionDate: 17-Jul-2002; LatestRevisionNote: Re-released for DXP Platform.; PackageReference: RAD-0.3; Publisher: Altium Limited; PackageDescription: Radial Cap, Thru-Hole; 2 Leads; 0.3 in Pin Spacing
C28-C30 = Cap Pol: Polarized Capacitor; ComponentLink1Description: datasheet; ComponentLink2Description: supplier; Value: 100u
D4 = SMBJ5.0A: 5.0V, 600W Surface Mount Transient Voltage Suppression Diode, SMBJ Series; Supplier 1: Farnell; Supplier 2: Farnell; Supplier 3: Farnell; Supplier 4: Farnell; Supplier 5: Farnell; Supplier 6: Farnell; Supplier 7: Farnell; Supplier 8: Farnell; Supplier 9: Farnell; Supplier 10: Farnell; Supplier 11: TME; Supplier 12: TME; Supplier 13: TME; Supplier Part Number 1: 9381554; Supplier Part Number 2: 1797897; Supplier Part Number 3: 9886311; Supplier Part Number 4: 2097845; Supplier Part Number 5: 1456972; Supplier Part Number 6: 7277792; Supplier Part Number 7: 9551107; Supplier Part Number 8: 2429079; Supplier Part Number 9: 2353654; Supplier Part Number 10: 2252493; Supplier Part Number 11: SMBJ5.0A-E3/52; Supplier Part Number 12: SMBJ5.0A-LF; Supplier Part Number 13: SMBJ5.0A-TR
J2 = CMP-2000-05487-1: SMA Right-Angle PCB Jack Receptacle, Brass Body, Gold Plated, 50 Ohm, 5-Pin THD, RoHS, Tray; Manufacturer: Molex; Datasheet Version: 09/2016; Package Description: 5-Pin Through Hole Device, Body 14.8 x 6.35 mm, Pitch 2.54 mm; Datasheet URL: http://www.molex.com/webdocs/datasheets/pdf/en-us/0731000114_RF_COAX_CONNECTORS.pdf; Manufacturer URL: http://www.molex.com/; Package Reference: 731000114; Mounting Technology: ThroughHole; Package URL: http://www.molex.com/pdm_docs/sd/731000114_sd.pdf
J3 = CMP-2000-05827-1: Micro-USB B Receptacle, Right Angle, Bottom Mount, Surface Mount, with Solder Tabs, -30 to 85 degC, 5-Pin USB, RoHS, Tape and Reel; Manufacturer: Molex; Featured Product: Micro-USBConnectorsUSBConnectors; Other Names: WM1399DKR; Package Version: Rev. F, 12/2012; Number of Contacts: 5; Connector Type: USB-microB; Catalog Drawings: 1050170001; 3D Model: 105017-0001.stp; Mating Products: WM17145-ND-CABLEMICROUSBBTOSTDA1.0MWM17147-ND-CABLEMICROUSBBTOSTDA2.0MWM17146-ND-CABLEMICROUSBBTOSTDA1.5M; PCN Assembly/Origin: ResinSupplier21/Oct/2015; Voltage - Max: 30V; Online Catalog: Molex-MicroUSB; Manufacturer URL: http://www.molex.com/; Package Description: 5-Leads USB, Micro B, Body 7.5 x 5 mm, Pitch 0.65 mm; Datasheet URL: http://www.molex.com/elqNow/elqRedir.htm?ref=http://www.molex.com/webdocs/datasheets/pdf/en-us/1050170001_IO_CONNECTORS.pdf; Ingress Protection: -; Datasheet Version: 03/2016; Mounting Type: BoardCutout,SurfaceMount,RightAngle; Circuits: 5; Standard Package: 1; Package Reference: MICRO-B; Package URL: http://www.molex.com/pdm_docs/sd/1050170001_sd.pdf; Category: Connectors,Interconnects; Series: -; RoHS Information: 1050170001CertofCompliance; Features: Shielded,SolderRetention; Family: USB,DVI,HDMIConnectors; Specifications: -; Gender: Receptacle; Packaging: Digi-Reel®; Mounting Technology: SurfaceMount
J4 = CMP-2000-07068-1: Nano SIM Card Connect Push-Pull Type, Profile Height 1.35 mm, 30 V Max, 0.5 A Max, -40 to 85 degC, 6-Pin SMT, RoHS, Tape and Reel; Manufacturer: Global Connector Technology; Pitch: 1.45mm; No of Positions: 6; Style/Orientation: Receptacle; Package Description: 6-Pin Surface Mount Device, Body 12.2 x 9.54 mm, Pitch 2.54 mm; Manufacturer URL: http://gct.co/; Datasheet Version: Rev. E, 09/2015; Datasheet URL: http://gct.co/sim-connectors/pdf/SIM8050.pdf; Type: Contact; Mounting Technology: SurfaceMount; Termination: PushPull; Package Reference: SIM8050-6-0-14-01-A
LED1 = CMP-1426-00011-1: SMD mono-color Chip LED, WL-SMCW, Red; Manufacturer: Wuerth Elektronik; Color: Red; PartNumber: 150080RS75000; PackageReference: 0805_A; ComponentLink2Description: Datasheet; ComponentLink1URL: http://www.we-online.com; ComponentLink1Description: Manufacturer URL; ComponentLink2URL: http://katalog.we-online.com/led/datasheet/150080RS75000.pdf
Q1 Q2 = CMP-1048-00019-1: General Purpose Transistor, NPN Silicon, 3-Pin SOT-23, Pb-Free, Tape and Reel; Manufacturer: On Semiconductor; fT Min (MHz): 100; IC Continuous (A): 0.5; ComponentLink2URL: http://www.onsemi.com/pub_link/Collateral/BC817-16LT1-D.PDF; DatasheetVersion: Rev. 12; ComponentLink3URL: http://www.onsemi.cn/pub_link/Collateral/318-08.PDF; ComponentLink3Description: Package Specification; ComponentLink1Description: Manufacturer URL; Mounting Technology: Surface Mount; ComponentLink1URL: http://www.onsemi.com/; Packing: Tape and Reel; ComponentLink2Description: Datasheet; Polarity: NPN; RoHS: TRUE; PackageVersion: Rev. AP, 11/2009; PartNumber: BC817-40LT1G; PackageDescription: 3-Pin Small Outline Transistor, Body 2.92 x 1.3 mm, Pitch 0.95 mm; PackageReference: SOT-23-3-318-08
R10-R18 = Res: Resistor; Published: 19-Feb-2006; ComponentLink1Description: datasheet; ComponentLink2Description: supplier
  R10 R13: Value: 4K7
  R11 R14: Value: 47K
  R15: Value: 51R
  R16-R18: Value: 22R
U3 = CMP-1061-00155-1: 5-Line Transient Voltage Suppressor Array, 6-Pin SC70, Pb-Free, Tape and Reel; Manufacturer: On Semiconductor; PPK Max (W): 100; Direction: Unidirectional; IR Max (uA): 5; PackageDescription: 6-Pin Small Outline Transistor, Body 2 x 1.25 mm, Pitch 0.65 mm; PackageReference: SC70-6-419B-02_W; ComponentLink2Description: Datasheet; Mounting Technology: Surface Mount; Packing: Tape and Reel; DatasheetVersion: Rev. 4; ComponentLink1Description: Manufacturer URL; ComponentLink2URL: http://www.onsemi.com/pub_link/Collateral/SMF05C-D.PDF; ComponentLink3Description: Package Specification; ComponentLink1URL: http://www.onsemi.com/; ComponentLink3URL: http://www.onsemi.com/pub_link/Collateral/SMF05C-D.PDF; PackageVersion: Rev. W; PartNumber: SMF05CT1G; RoHS: Pb-Free
U*1 = SIM7020E: Narrowband-IoT communication module; Control Via AT Commands; UART; SIM card (1.8V/3V) GPIO; ADC; Netlight; PSM_EINT; Reset; Powerkey; Supply voltage range: 2.1V-3.6V;; ComponentLink1Description: Documentation; ComponentLink1URL: https://simcom.ee/documents/SIM7020/SIM7020%20Hardware%20Design_V1.02.pdf; ComponentLink2Description: Product site; ComponentLink2URL: https://simcom.ee/modules/iot/sim7020/

## Sheet RF.SchDoc: STM32WB55RG RF part
size A4; Author: PhA; SheetNumber: 3; SheetTotal: 6
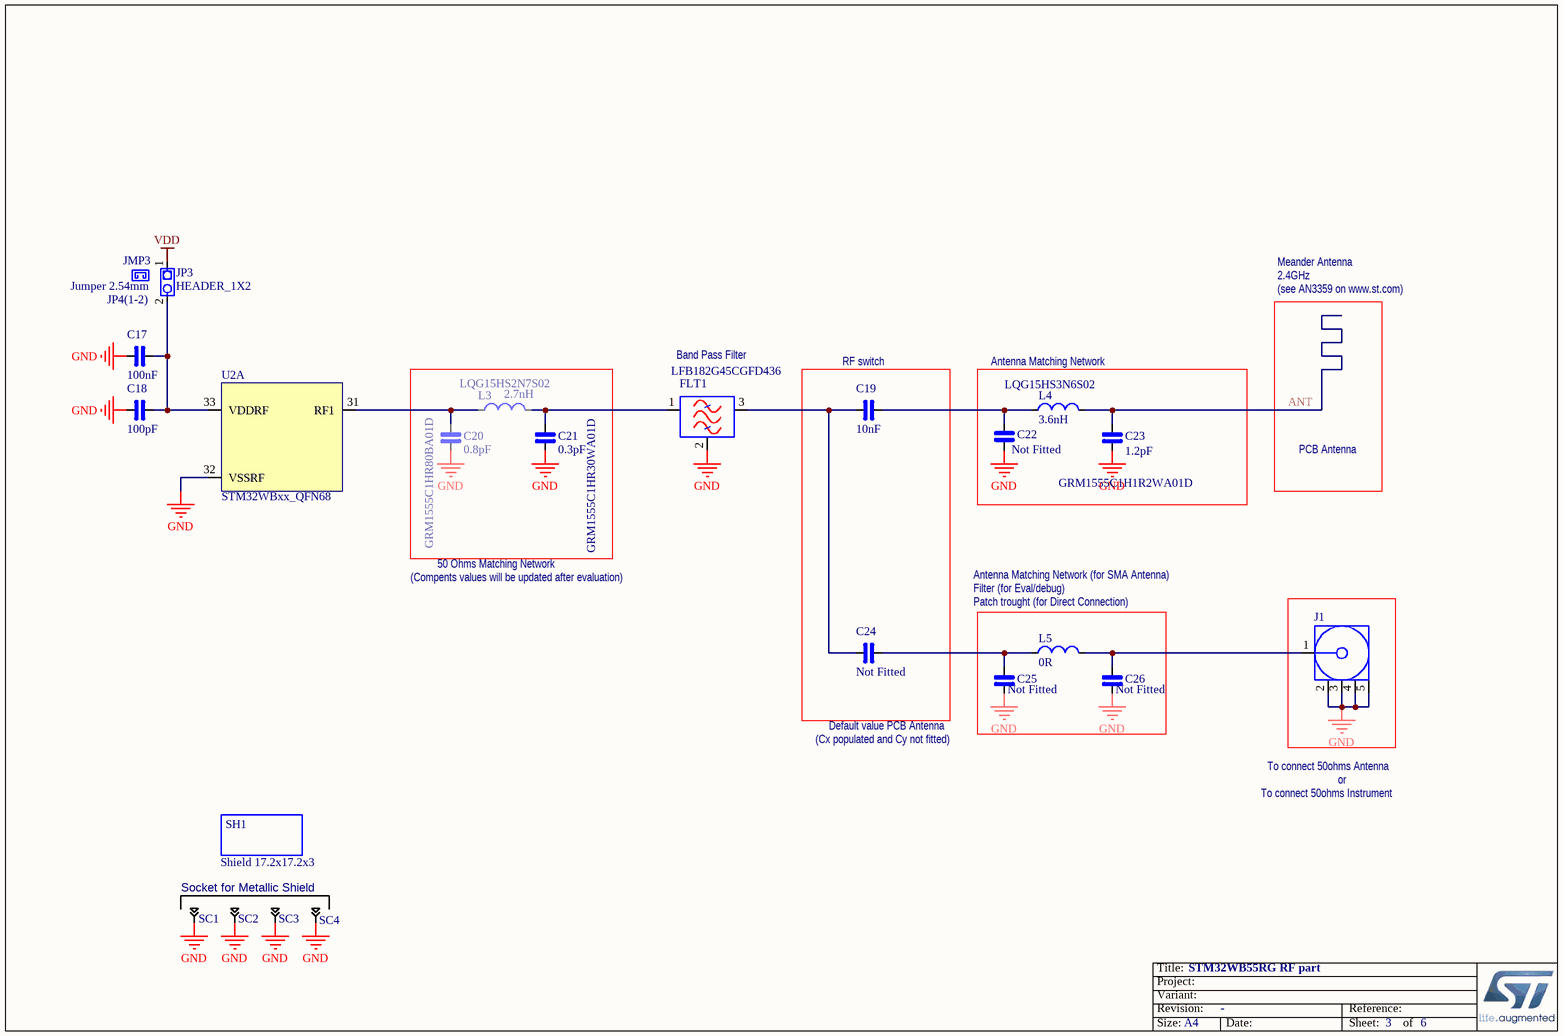
[diagram p6: RF.SchDoc]

### Parts
C17  100nF  [0603_CAP_NPOL]
C18  100pF  [0603_CAP_NPOL]
C19  10nF  [0603_CAP_NPOL]
C20  0.8pF  REF: GRM1555C1HR80BA01D  [0603_CAP_NPOL]
C21  0.3pF  REF: GRM1555C1HR30WA01D  [0603_CAP_NPOL]
C22  Fitted: Not Fitted  [0603_CAP_NPOL]
C23  1.2pF  Ref: GRM1555C1H1R2WA01D  [0603_CAP_NPOL]
C24  Fitted: Not Fitted  [0603_CAP_NPOL]
C25  Fitted: Not Fitted  [0603_CAP_NPOL]
C26  Fitted: Not Fitted  [0603_CAP_NPOL]
FLT1  LFB182G45CGFD436  [LFB182G45CGFD436]
J1  731000114  [MOLX-731000114_V]  (value not drawn)
JMP3  Jumper 2.54mm  default: JP4(1-2)  [Jumper 2.54mm BLACK]
JP3  HEADER_1X2  [GP_2x1_2mm]
L3  2.7nH  Ref: LQG15HS2N7S02  [0402_COIL]
L4  3.6nH  Ref: LQG15HS3N6S02  [0402_COIL]
L5  0R  [0402_COIL]
SC1  Shield Clip_A 3.9x1.1x1.28  [Shield Clip_A 3.9x1.1x1.28]  (value not drawn)
SC2  Shield Clip_A 3.9x1.1x1.28  [Shield Clip_A 3.9x1.1x1.28]  (value not drawn)
SC3  Shield Clip_A 3.9x1.1x1.28  [Shield Clip_A 3.9x1.1x1.28]  (value not drawn)
SC4  Shield Clip_A 3.9x1.1x1.28  [Shield Clip_A 3.9x1.1x1.28]  (value not drawn)
SH1  Shield 17.2x17.2x3  [Shield 17.2x17.2x3]
U2  STM32WBxx_QFN68  [VFQFPN68_8x8x0.1_p0.4]  (part A of 5)

### Blocks framed on the sheet
RF switch: C19 C24
Antenna Matching Network: C22 C23 L4

### Nets
GND: C17.1 C18.1 C20.1 C21.1 C22.2 C23.1 C25.1 C26.1 FLT1.2(GND) J1.2 J1.3 J1.4 J1.5 SC1.1 SC2.1 SC3.1 SC4.1 U2.32(VSSRF)  [project net BS0]
VDD: JP3.1  [project net 3V3]
ANT: C23.2 L4.2
NetC17_2: C17.2 C18.2 JP3.2 U2.33(VDDRF)
NetC19_1: C19.1 C24.1 FLT1.3(I/O)
NetC19_2: C19.2 C22.1 L4.1
NetC20_2: C20.2 L3.1 U2.31(RF1)
NetC21_2: C21.2 FLT1.1(I/O) L3.2
NetC24_2: C24.2 C25.2 L5.1
NetC26_2: C26.2 J1.1 L5.2

### Notes on the sheet
- Meander Antenna
- 2.4GHz
- (see AN3359 on www.st.com)
- (near FLT1) Band Pass Filter
- PCB Antenna
- (Compents values will be updated after evaluation)
- 50 Ohms Matching Network
- Antenna Matching Network (for SMA Antenna)
- Filter (for Eval/debug)
- Patch trought (for Direct Connection)
- (near C25) (Cx populated and Cy not fitted)
- Default value PCB Antenna
- To connect 50ohms Antenna
- or
- To connect 50ohms Instrument
- Socket for Metallic Shield
- Title:
- Project:
- Size:
- Revision:
- Variant:
- A4
- -
- Date:
- Reference:
- Sheet:
- of

### Library data of the parts
C17 C18 C20-C26 = CAP_NPOL: Capacitor_not polarized
  C23: Fitted: Fitted
C19 = CAP_NPOL: Capacitor_not polarized; Ref: Murata GRM155R71H103KA88
FLT1 = LFB182G45CGFD436: Band Pass Filter Murata LFB182G45CGFD436
J1 = CMP-2000-05487-1: as J2 on sheet NB_IoT; Datasheet Version: 09/2016; Package Description: 5-Pin Through Hole Device, Body 14.8 x 6.35 mm, Pitch 2.54 mm; Datasheet URL: http://www.molex.com/webdocs/datasheets/pdf/en-us/0731000114_RF_COAX_CONNECTORS.pdf; Manufacturer URL: http://www.molex.com/; Package Reference: 731000114; Mounting Technology: ThroughHole; Package URL: http://www.molex.com/pdm_docs/sd/731000114_sd.pdf
JP3 = HEADER_1X2_L
L3-L5 = INDUCTOR_SMD_STDL
SC1-SC4 = Shield Clip_A 3.9x1.1x1.28: Harwin S0951-46R
SH1 = Shield

## Sheet LEDs.SchDoc
size A4
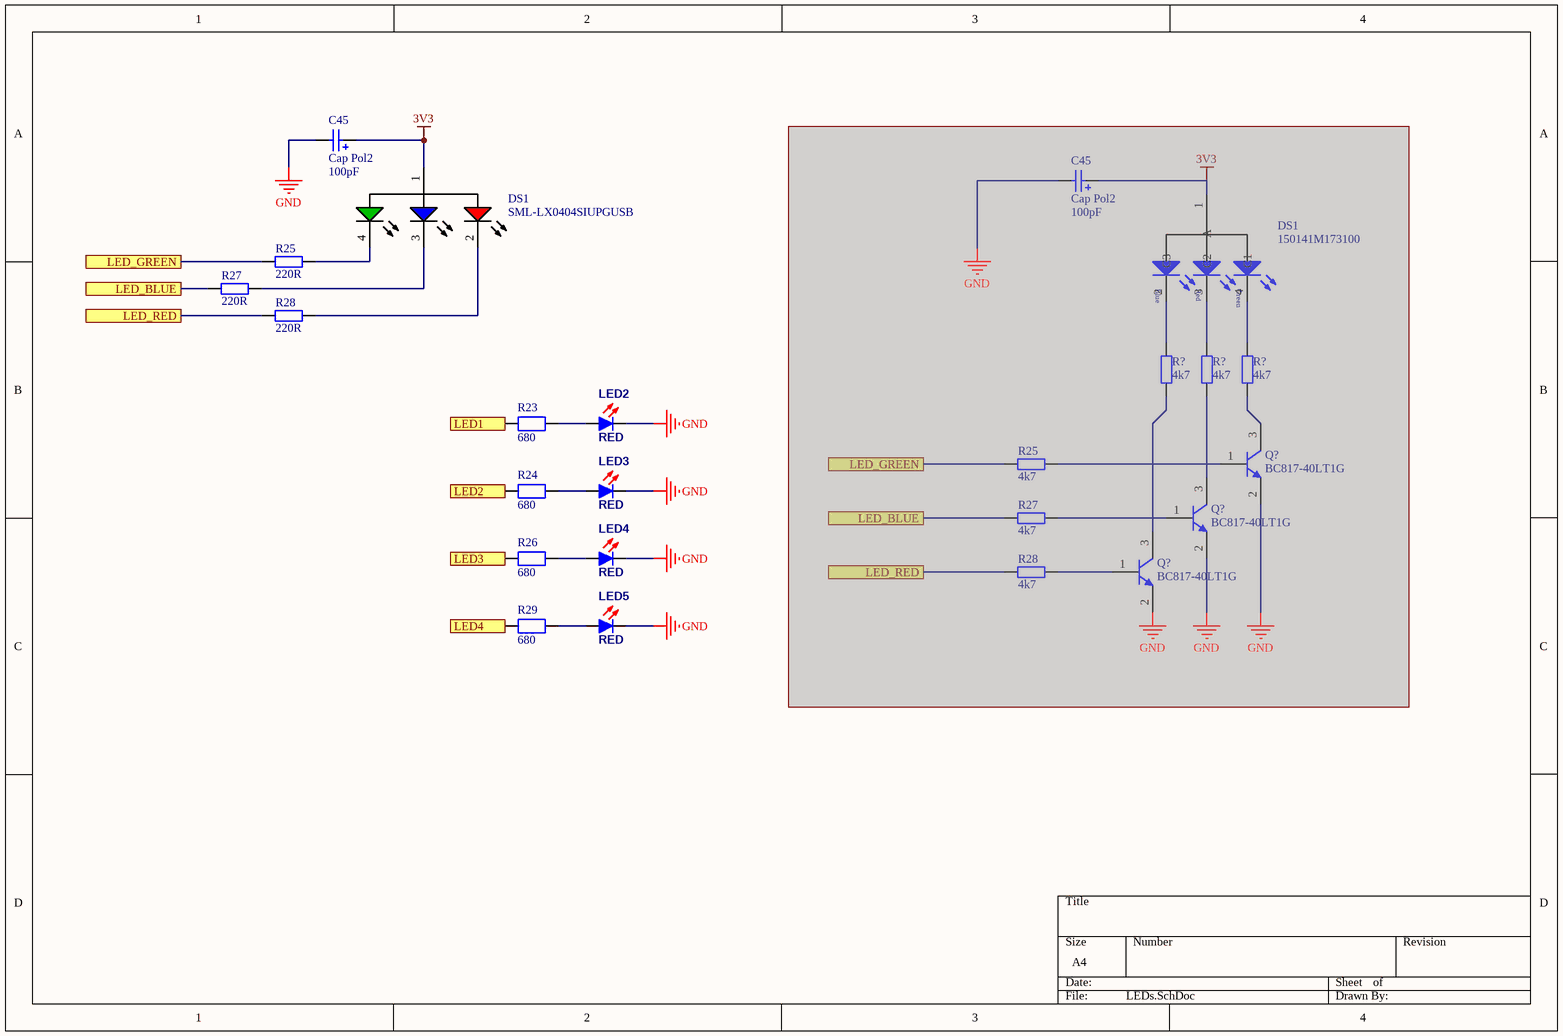
[diagram p7: LEDs.SchDoc]

### Parts
(Parts that share a designator on the sheet are numbered #1, #2 ... from top to bottom, then left to right.)
C45#1  Cap Pol2  value 100pF  [0603_CAP_NPOL]
C45#2  Cap Pol2  value 100pF  [0603_CAP_NPOL]  (masked out: inside a compile mask, not in the netlist)
DS1#1  SML-LX0404SIUPGUSB  [LUMX-SML-LX0404SIUPGUSB-4_V]
DS1#2  150141M173100  [3528_A]  (masked out: inside a compile mask, not in the netlist)
LED2  RED  [LED0805R]
LED3  RED  [LED0805R]
LED4  RED  [LED0805R]
LED5  RED  [LED0805R]
Q?#1  BC817-40LT1G  [ONSC-SOT-23-3-318-08_V]  (masked out: inside a compile mask, not in the netlist)
Q?#2  BC817-40LT1G  [ONSC-SOT-23-3-318-08_V]  (masked out: inside a compile mask, not in the netlist)
Q?#3  BC817-40LT1G  [ONSC-SOT-23-3-318-08_V]  (masked out: inside a compile mask, not in the netlist)
R23  680  [0402_RES]
R24  680  [0402_RES]
R25#1  value 220R  [0402_RES]  (hidden comment: Res2)
R25#2  value 4k7  [0402_RES]  (hidden comment: Res2)  (masked out: inside a compile mask, not in the netlist)
R26  680  [0402_RES]
R27#1  value 220R  [0402_RES]
R27#2  value 4k7  [0402_RES]  (masked out: inside a compile mask, not in the netlist)
R28#1  value 220R  [0402_RES]
R28#2  value 4k7  [0402_RES]  (masked out: inside a compile mask, not in the netlist)
R29  680  [0402_RES]
R?#1  value 4k7  [0402_RES]  (hidden comment: Res2)  (masked out: inside a compile mask, not in the netlist)
R?#2  value 4k7  [0402_RES]  (hidden comment: Res2)  (masked out: inside a compile mask, not in the netlist)
R?#3  value 4k7  [0402_RES]  (hidden comment: Res2)  (masked out: inside a compile mask, not in the netlist)

### Ports
LED1, LED2, LED3, LED4, LED_BLUE, LED_GREEN, LED_RED

### Nets
3V3: C45#1.1 DS1#1.1(A)
GND: C45#1.2 LED2.2(K) LED3.2(K) LED4.2(K) LED5.2(K)  [project net BS0]
LED1: R23.1 ; port LED1
LED2: R24.1 ; port LED2
LED3: R26.1 ; port LED3
LED4: R29.1 ; port LED4
LED_BLUE: R27#1.1 ; port LED_BLUE
LED_GREEN: R25#1.1 ; port LED_GREEN
LED_RED: R28#1.1 ; port LED_RED
NetDS1#1_2: DS1#1.2(R) R28#1.2
NetDS1#1_3: DS1#1.3(B) R27#1.2
NetDS1#1_4: DS1#1.4(G) R25#1.2
NetLED2_1: LED2.1(A) R23.2
NetLED3_1: LED3.1(A) R24.2
NetLED4_1: LED4.1(A) R26.2
NetLED5_1: LED5.1(A) R29.2

### Notes on the sheet
- (in symbol CMP-1431-00001-1) Blue; Red; Green

### Library data of the parts
C45#1 C45#2 = Cap Pol2: Polarized Capacitor (Axial); Published: 8-Jun-2000; LatestRevisionDate: 17-Jul-2002; LatestRevisionNote: Re-released for DXP Platform.; PackageReference: POLAR0.8; Publisher: Altium Limited; PackageDescription: Polarized Capacitor; 2 Leads
DS1#1 = CMP-2000-07119-1: Full Color, Water Clear Lens, -40 to 85 degC, 4-Pin SML (0404), RoHS, Tape and Reel; LED Size: 1mmx1mm; Brand: Lumex; Luminous Intensity: 30mcd; Forward Current: 2mA; Viewing Angle: 120deg; Illumination Color: RGB; Package Version: Rev. B, 06/2015; Maximum Operating Temperature: +85C; Package Reference: 0404; PartNumber: SML-LX0404SIUPGUSB; Manufacturer: Lumex; Product Category: StandardLEDs-SMD; Lens Color/Style: WaterClear; Packaging: Reel; Minimum Operating Temperature: -40C; Datasheet Version: Rev. B, 06/2015; Datasheet URL: http://www.lumex.com/content/files/ProductAttachment/SML-LX0404SIUPGUSB.pdf; RoHS: Details; Package / Case: 0404; Mounting Technology: SurfaceMount; Package Description: 4-Pin Surface Mount Device, Body 1 x 1 mm, Pitch 0.85 mm; Factory Pack Quantity: 2000; Manufacturer URL: http://www.lumexinstruments.com/
DS1#2 = CMP-1431-00001-1: SMD Full-Color Top LED, WL-SFTW, Red & Green & Blue; Manufacturer: Wuerth Elektronik; PackageReference: 3528_A; PartNumber: 150141M173100; ComponentLink2Description: Datasheet; ComponentLink1URL: http://www.we-online.com; Color: Red & Green & Blue; ComponentLink1Description: Manufacturer URL; ComponentLink2URL: http://katalog.we-online.com/led/datasheet/150141M173100.pdf
LED2-LED5 = LED_RED: RED LED; Published: 04-Apr-2006
Q?#1-Q?#3 = CMP-1048-00019-1: as Q1 on sheet NB_IoT; ComponentLink2URL: http://www.onsemi.com/pub_link/Collateral/BC817-16LT1-D.PDF; DatasheetVersion: Rev. 12; ComponentLink3URL: http://www.onsemi.cn/pub_link/Collateral/318-08.PDF; ComponentLink3Description: Package Specification; ComponentLink1Description: Manufacturer URL; Mounting Technology: Surface Mount; ComponentLink1URL: http://www.onsemi.com/; Packing: Tape and Reel; ComponentLink2Description: Datasheet; Polarity: NPN; RoHS: TRUE; PackageVersion: Rev. AP, 11/2009; PartNumber: BC817-40LT1G; PackageDescription: 3-Pin Small Outline Transistor, Body 2.92 x 1.3 mm, Pitch 0.95 mm; PackageReference: SOT-23-3-318-08
R23 R24 R26 R29 = RES: Resistor
R25#1 R25#2 R27#1 R27#2 R28#1 R28#2 R?#1-R?#3 = Res2: Resistor; Published: 8-Jun-2000; LatestRevisionDate: 17-Jul-2002; LatestRevisionNote: Re-released for DXP Platform.; PackageReference: AXIAL-0.4; Publisher: Altium Limited; PackageDescription: Axial Device, Thru-Hole; 2 Leads; 0.4 in Pin Spacing

## Sheet SENSORS.SchDoc
size A4
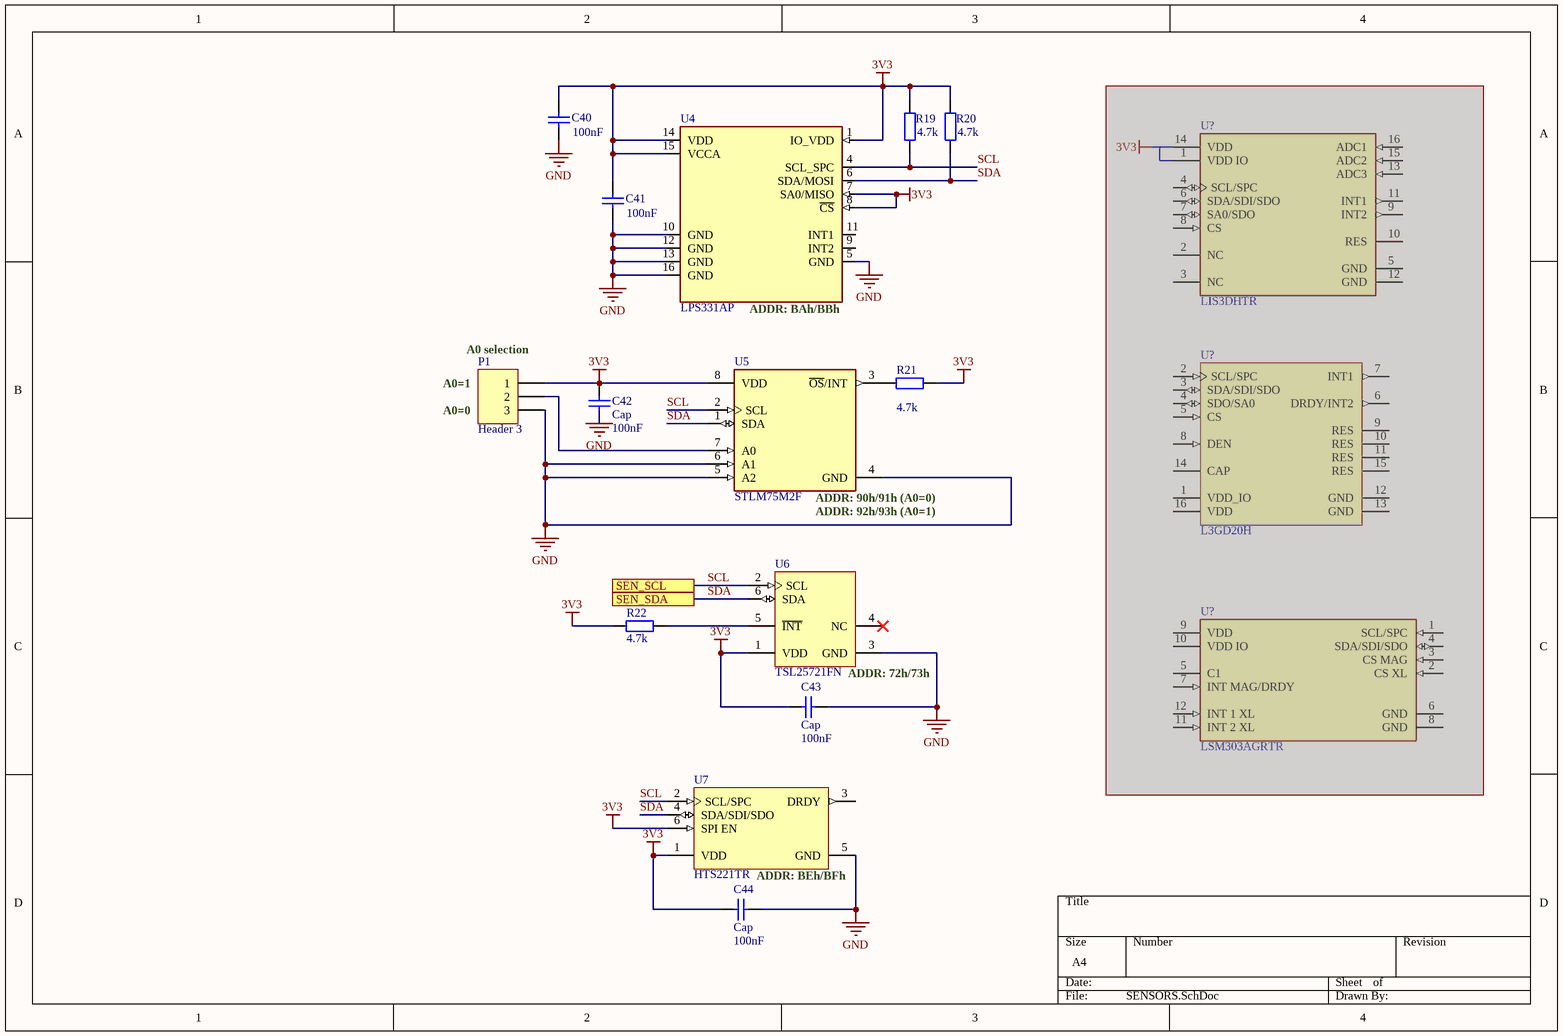
[diagram p8: SENSORS.SchDoc]

### Parts
(Parts that share a designator on the sheet are numbered #1, #2 ... from top to bottom, then left to right.)
C40  value 100nF  [0603_CAP_NPOL]  (hidden comment: Cap)
C41  value 100nF  [0603_CAP_NPOL]  (hidden comment: Cap)
C42  Cap  value 100nF  [0603_CAP_NPOL]
C43  Cap  value 100nF  [0603_CAP_NPOL]
C44  Cap  value 100nF  [0603_CAP_NPOL]
P1  Header 3  [GP_3x1_2mm]
R19  value 4.7k  [0402_RES]  (hidden comment: hy)
R20  value 4.7k  [0402_RES]  (hidden comment: hy)
R21  value 4.7k  [0402_RES]  (hidden comment: Res2)
R22  value 4.7k  [0402_RES]  (hidden comment: Res2)
U4  LPS331AP  [HCLGA-16/3MM]
U5  STLM75M2F  [FP-SO8-SO-A-MFG]
U6  TSL25721FN  [AMS-FN-6-2000X2000DE_V]
U7  HTS221TR  [STM-HTS221-HLGA-6]
U?#1  LIS3DHTR  [FP-LGA-16-7983231-MFG]  (masked out: inside a compile mask, not in the netlist)
U?#2  L3GD20H  [STM-LGA-16]  (masked out: inside a compile mask, not in the netlist)
U?#3  LSM303AGRTR  [FP-LGA-12-8487206-MFG]  (masked out: inside a compile mask, not in the netlist)

### Ports
SEN_SCL, SEN_SDA

### Nets
3V3: C40.2 C41.2 C42.2 C43.1 C44.1 P1.1 R19.2 R20.2 R21.2 R22.1 U4.1(IO_VDD) U4.7(SA0/MISO) U4.8(~{CS}) U4.14(VDD) U4.15(VCCA) U5.8(VDD) U6.1(VDD) U7.1(VDD) U7.6(SPI_EN)
GND: C40.1 C41.1 C42.1 C43.2 C44.2 P1.3 U4.5(GND) U4.10(GND) U4.12(GND) U4.13(GND) U4.16(GND) U5.4(GND) U5.5(A2) U5.6(A1) U6.3(GND) U7.5(GND)  [project net BS0]
SCL: R19.1 U4.4(SCL_SPC) U5.2(SCL) U6.2(SCL) U7.2(SCL/SPC) ; port SEN_SCL  [project net D15]
SDA: R20.1 U4.6(SDA/MOSI) U5.1(SDA) U6.6(SDA) U7.4(SDA/SDI/SDO) ; port SEN_SDA  [project net D14]
NetP1_2: P1.2 U5.7(A0)
NetR21_1: R21.1 U5.3(~{OS}/INT)
NetR22_2: R22.2 U6.5(~{INT})

Not connected (* = marked no-connect by the designer): U4 9(INT2) 11(INT1); U6 4(NC)*; U7 3(DRDY)

### Notes on the sheet
- (near U4) ADDR: BAh/BBh
- (near P1) A0=1
- (near P1) A0 selection
- (near P1) A0=0
- (near U5) ADDR: 90h/91h (A0=0)
- (near U5) ADDR: 92h/93h (A0=1)
- (near U6) ADDR: 72h/73h
- (near U7) ADDR: BEh/BFh

### Library data of the parts
C40-C44 = Cap: Capacitor; Published: 8-Jun-2000; LatestRevisionDate: 17-Jul-2002; LatestRevisionNote: Re-released for DXP Platform.; PackageReference: RAD-0.3; Publisher: Altium Limited; PackageDescription: Radial Cap, Thru-Hole; 2 Leads; 0.3 in Pin Spacing
P1 = Header 3: Header, 3-Pin; LatestRevisionDate: 17-Jul-2002; LatestRevisionNote: Re-released for DXP Platform.; Publisher: Altium Limited
R19 R20 R22 = Res2: Resistor; Published: 8-Jun-2000; LatestRevisionDate: 17-Jul-2002; LatestRevisionNote: Re-released for DXP Platform.; PackageReference: AXIAL-0.4; Publisher: Altium Limited; PackageDescription: Axial Device, Thru-Hole; 2 Leads; 0.4 in Pin Spacing
U4 = LPS331AP: IC PRESSURE SENSOR PIEZO 16HCLGA; Package: None; Price: None; Value: *; MP: LPS331AP; Availability: Unavailable
U5 = CMP-12184-000001-1: SENSOR DIGITAL -55C-125C 8SO; Manufacturer: STMicroelectronics; Max Supply Voltage: 5.5V; Standoff Height: 0.1mm; Operating Supply Current: 70-125uA; Resolution: 9bits; Interface: I2C,SMBus; Min Supply Voltage: 2.7V; Output Current: 10mA; Manufacturer Part Number: STLM75M2F; Device Class L1: Sensors; RoHS: TRUE; Package: SO8-SO-A; Height: 1.75mm; ComponentLink2URL: https://www.st.com/resource/en/datasheet/stlm75.pdf; Automotive: No; Mouser Description: STLM75 Series 5.5 V 10 mA Digital Temperature Sensor and Thermal Watchdog; Ambient Temperature Range Low: -55°C; Temperature Range High: +125°C; Octopart: https://octopart.com/stlm75m2f-stmicroelectronics-7122040; Digikey Description: SENSOR DIGITAL -55C-125C 8SO; Footprint Url: https://www.st.com/content/ccc/resource/technical/document/datasheet/group3/16/9a/68/4c/7d/03/4a/09/DM00396770/files/DM00396770.pdf/jcr:content/translations/en.DM00396770.pdf; Ipc Land Pattern Name: SOIC127P600X175-8; Category: IC; Temperature Range Low: -55°C; Device Class L3: unset; Ambient Temperature Range High: +125°C; Device Class L2: Temperature and Humidity Sensors; Lead Free: Yes; Temperature: -55°C to +125°C; ComponentLink2Description: Datasheet; Sensor Output: I2C,SMBus
U6 = CMP-0550-00028-2: Ambient Light Sensor, I2C Vbus = VDD Interface, 2.4 to 3.6 V, FN-6, Pb-Free, Reel; Manufacturer: AMS; Programmable: Gain, Integration Time, Interrupt; Interface: I2C - Vdd; Maximum Lux: 60000; Supply Voltage (V): 2.4 - 3.6; ComponentLink1Description: Manufacturer URL; ComponentLink2URL: http://www.ams.com/eng/content/download/291224/1065822/166800; PackageDescription: 6-Pin Dual Flat No-Lead, 2 x 2 mm Body, 0.65 mm Pitch; ComponentLink2Description: Datasheet; Mounting Technology: Surface Mount; PackageReference: FN-6; DatasheetVersion: TAOS132; ComponentLink1URL: www.ams.com; PackageVersion: TAOS059Q, 11/2009; PartNumber: TSL25721FN
U7 = CMP-2000-06428-1: Capacitive Digital Sensor for Relative Humidity and Temperature, 1.7 to 3.6 V, -40 to 120 degC, 6-Pin HLGA, RoHS, Tape and Reel; Manufacturer: STMicroelectronics; PartNumber: HTS221; Voltage - Supply: 1.7V~3.6V; Output Type: I²C,SPI; Voltage Supply Min: 1.7V; Accuracy: ±4.5%RH; Sensor Type: Humidity,Temperature; Voltage Supply Max: 3.6V; Response Time: 10s; Output: 16b; Humidity Range: 0~100%RH; Series: -; Category: Sensors,Transducers; Mounting Technology: SurfaceMount; Sensitivity: -; Datasheet URL: http://www2.st.com/content/ccc/resource/technical/document/datasheet/4d/9a/9c/ad/25/07/42/34/DM00116291.pdf/files/DM00116291.pdf/jcr:content/translations/en.DM00116291.pdf; Family: Humidity,MoistureSensors; Manufacturer URL: http://www.st.com/; Package Reference: HTS221-HLGA-6; Operating Temperature: -40°C~120°C; Mounting Type: SurfaceMount; Package Description: 6-Pin Top-Holed Cap Land Grid Array, Body 2 x 2 mm; Datasheet Version: Rev. 3, 10/2015
U?#1 = CMP-0234-00055-5: ACCEL 2-16G I2C/SPI 16LGA; Interface: I2C; Bandwidth: 5kHz; Operating Supply Voltage: 2.5V; Min Supply Voltage: 1.71V; Resolution: 16b; Max Supply Voltage (DC): 3.6V; Axis: X, Y, Z; Operating Supply Current: 11uA; Sensor Type: 3 Axis; Output Type: Digital; Lead Free: Lead Free; Case/Package: LGA; REACH SVHC: No SVHC; Width: 3mm; Height: 1mm; Packaging: Tape and Reel; Contact Plating: Gold; Length: 3mm; Package Quantity: 1; Min Supply Voltage (DC): 1.71V; Max Operating Temperature: 85°C; Min Operating Temperature: -40°C; Number of Pins: 16; Radiation Hardening: No; Depth: 3mm; Max Supply Voltage: 3.6V
U?#2 = CMP-1771-00002-2: MEMS Motion Sensor: Three-Axis Digital Output Gyroscope, 2.2 to 3.6 V, -40 to 85 degC, 16-Pin LGA, RoHS, Tray; ESR: 200 Ohm; Load Capacitance: 18 pF; Capacitance: 1.8E-11 f; Frequency: 8 MHz; Frequency Tolerance: 20ppm; DatasheetVersion: Rev. 2, 03/2013; ComponentLink1Description: Manufacturer URL; Length: 0.197 inch; Mount: Surface Mount; REACH SVHC: Unknown; ComponentLink2URL: http://www.st.com/content/ccc/resource/technical/document/datasheet/35/b1/e0/39/71/57/43/01/DM00060659.pdf/files/DM00060659.pdf/jcr:content/translations/en.DM00060659.pdf; Min Operating Temperature: -20degC; Height: 0.043 inch; Max Operating Temperature: 70degC; ComponentLink1URL: http://www.st.com/; Case/Package: CSMD; Packaging: Tape and Reel; Width: 0.126 inch; Resistance: 200 Ohm; ComponentLink2Description: Datasheet; Package Quantity: 1000; RoHSCompliant: True; Pins: 4; Tolerance: 20ppm; PackageReference: LGA-16; PackageDescription: 16-Pin Land Grid Array Package, Body 3 x 3 mm, Pitch 0.5 mm
U?#3 = CMP-2000-07465-2: IMU ACCEL/MAG I2C/SPI 12LGA; Manufacturer: STMicroelectronics; Accel Range: 2/4/8/16g; Operating Supply Current: 3.7-200uA; Sensor Output: I2C,SPI; Accel Resolution: 16bits; Max Supply Voltage: 3.6V; Min Supply Voltage: 1.71V; Mag Sense Range: 49.152gauss (g); Sensor Type: Temperature,Accelerometer,Magnetometer; Mouser Description: IMUs - Inertial Measurement Units Ultra-compact high-performance e-compass 3D accelerometer and 3D magnetometer module; Temperature Range High: +85°C; Package: LGA-12-8487206; Manufacturer Part Number: LSM303AGRTR; Category: IC; Device Class L3: Inertial Measurement Units (IMUs); Temperature: -40°C to +85°C; Device Class L2: Motion Sensors; ComponentLink2Description: Datasheet; Octopart: https://octopart.com/lsm303agrtr-stmicroelectronics-59386630; Automotive: No; Device Class L1: Sensors; Resolution: 16bits; RoHS: TRUE; Height: 1mm; ComponentLink2URL: https://www.st.com/resource/en/datasheet/lsm303agr.pdf; Lead Free: Yes; Temperature Range Low: -40°C; Footprint Url: https://www.st.com/content/ccc/resource/technical/document/technical_note/73/17/9c/16/dd/96/4a/01/CD00134799.pdf/files/CD00134799.pdf/jcr:content/translations/en.CD00134799.pdf; Digikey Description: IMU ACCEL/MAG I2C/SPI 12LGA
R21 = Res2: Published: 8-Jun-2000; LatestRevisionDate: 17-Jul-2002; LatestRevisionNote: Re-released for DXP Platform.; PackageReference: AXIAL-0.4; Publisher: Altium Limited; PackageDescription: Axial Device, Thru-Hole; 2 Leads; 0.4 in Pin Spacing

## Sheet Supply.SchDoc
size A4
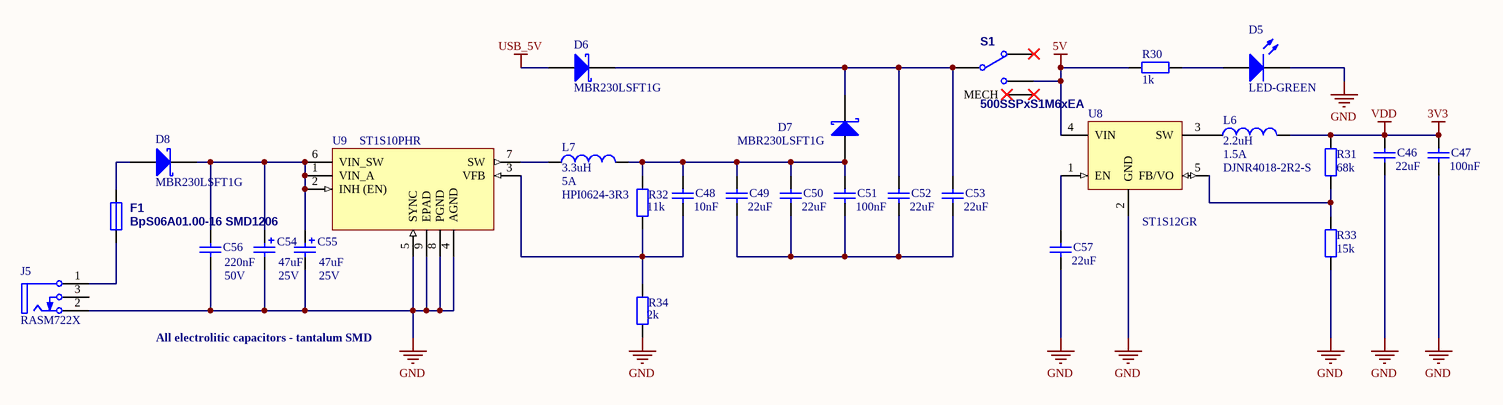
[diagram p9: Supply.SchDoc]

### Parts
C46  value 22uF  [C1206]  (hidden comment: Cap)
C47  value 100nF  [C1206]  (hidden comment: Cap)
C48  value 10nF  [C1206]  (hidden comment: Cap)
C49  value 22uF  [C1206]  (hidden comment: Cap)
C50  value 22uF  [C1206]  (hidden comment: Cap)
C51  value 100nF  [C1206]  (hidden comment: Cap)
C52  value 22uF  [C1206]  (hidden comment: Cap)
C53  value 22uF  [C1206]  (hidden comment: Cap)
C54  25V  value 47uF  [SMDB]
C55  25V  value 47uF  [SMDB]
C56  50V  value 220nF  [C1206]
C57  value 22uF  [C1206]  (hidden comment: Cap)
D5  LED-GREEN  [LED0603G]
D6  MBR230LSFT1G  [SMB]
D7  MBR230LSFT1G  [SMB]
D8  MBR230LSFT1G  [SMB]
F1  BpS06A01.00-16 SMD1206  [F1206]
J5  RASM722X  [SWIT-RASM722X_V]
L6  DJNR4018-2R2-S  value 2.2uH  Value2: 1.5A  [L2220_3]
L7  HPI0624-3R3  value 3.3uH  Value2: 5A  [DE0703]
R30  value 1k  [6-0805_L]  (hidden comment: Res2)
R31  value 68k  [6-0805_L]  (hidden comment: Res2)
R32  value 11k  [6-0805_L]  (hidden comment: Res2)
R33  value 15k  [6-0805_L]  (hidden comment: Res2)
R34  value 2k  [6-0805_L]  (hidden comment: Res2)
S1  500SSPxS1M6xEA  [500SSPxS1M6xEA]
U8  ST1S12GR  [TSOT23-5L_L]
U9  ST1S10PHR  [HSO-8_L]

### Nets
3V3: C46.2 C47.2 L6.2 R31.2  [also labelled VDD]
5V: R30.1 S1.3 U8.4(VIN)
GND: C46.1 C47.1 C54.2 C55.2 C56.1 C57.1 D5.2(K) J5.2(TIP) R33.1 R34.1 U8.2(GND) U9.4(AGND) U9.5(SYNC) U9.8(PGND) U9.9(EPAD)  [project net BS0]
USB_5V: D6.1(A)
NetC48_1: C48.1 R32.1 R34.2 U9.3(VFB)
NetC48_2: C48.2 C49.2 C50.2 C51.2 D7.1(A) L7.2 R32.2
NetC49_1: C49.1 C50.1 C51.1 C52.1 C53.1
NetC52_2: C52.2 C53.2 D6.2(K) D7.2(K) S1.2
NetC54_1: C54.1 C55.1 C56.2 D8.2(K) U9.1(VIN_A) U9.2(INH_(EN)) U9.6(VIN_SW)
NetC57_2: C57.2 U8.1(EN)
NetD5_1: D5.1(A) R30.2
NetD8_1: D8.1(A) F1.2
NetF1_1: F1.1 J5.1(SLEEVE)
NetL6_1: L6.1 U8.3(SW)
NetL7_1: L7.1 U9.7(SW)
NetR31_1: R31.1 R33.2 U8.5(FB/VO)

Not connected (* = marked no-connect by the designer): J5 3(SHUNT); S1 1* M(MECH)*

### Notes on the sheet
- All electrolitic capacitors - tantalum SMD

### Library data of the parts
C46-C53 C56 C57 = Cap: Capacitor; Published: 8-Jun-2000; LatestRevisionDate: 17-Jul-2002; LatestRevisionNote: Re-released for DXP Platform.; PackageReference: RAD-0.3; Publisher: Altium Limited; PackageDescription: Radial Cap, Thru-Hole; 2 Leads; 0.3 in Pin Spacing
C54 C55 = Cap Pol2: Polarized Capacitor (Axial); Published: 8-Jun-2000; LatestRevisionDate: 17-Jul-2002; LatestRevisionNote: Re-released for DXP Platform.; PackageReference: POLAR0.8; Publisher: Altium Limited; PackageDescription: Polarized Capacitor; 2 Leads
D5 = LED0: Typical INFRARED GaAs LED; Published: 8-Jun-2000; LatestRevisionDate: 08-Jul-2005; LatestRevisionNote: Mech Layer 1 removed.; PackageReference: LED-0; Publisher: Altium Limited; PackageDescription: LED; 2 Leads
D6-D8 = D Schottky: Schottky Diode; Published: 8-Jun-2000; LatestRevisionDate: 17-Jul-2002; LatestRevisionNote: Re-released for DXP Platform.; PackageReference: SMB; Publisher: Altium Limited; PackageDescription: DO-214-AA/SMB; 2 C-Bend Leads; Body 5.3 x 3.6 mm, inc. leads (LxW); Code_JEDEC: DO-214-AA
F1 = 1206 Fuse: Published: 8-Jun-2000; LatestRevisionDate: 17-Jul-2002; LatestRevisionNote: Re-released for DXP Platform.; PackageReference: PIN-W2/E2.8; Publisher: Altium Limited; PackageDescription: Thru-Hole; 2 Leads
J5 = JACK-2CD3-TN: Power Jack, 5 A, 250 V, 3-Pin SMD, RoHS, Bulk; ComponentLink1URL: http://www.switchcraft.com/; ComponentLink2URL: http://www.switchcraft.com/Drawings/rasm732x_cd.pdf; ComponentLink1Description: Manufacturer URL; PackageReference: RASM722X; ComponentLink2Description: Datasheet; DatasheetVersion: Rev. A, 09/2005; PackageDescription: 3-Pin Surface Mount Device, Body 14.5 x 9 mm
L6 L7 = Inductor: Code_IEC: 1005; Published: 8-Jun-2000; LatestRevisionDate: 29-May-2009; LatestRevisionNote: IPC-7351 Footprint Added.; PackageReference: 0402-A; Publisher: Altium Limited; PackageDescription: Chip Inductor; Code_JEITA: 0402
R30-R34 = Res2: Resistor; Published: 8-Jun-2000; LatestRevisionDate: 17-Jul-2002; LatestRevisionNote: Re-released for DXP Platform.; PackageReference: AXIAL-0.4; Publisher: Altium Limited; PackageDescription: Axial Device, Thru-Hole; 2 Leads; 0.4 in Pin Spacing
S1 = 500SSPxS1M6xEA: E-Switches SPDT AC: 3A/250V, DC: 6A/28V; Supplier 1: Digi-Key; Supplier Part Number 1: EG2478-ND
U8 = PM-SWREG-ST1S12G-IL5: Synchronous rectification with inhibit, 0.7 A, 1.7 MHz adjustable, step-down switching regulator, 5-Pin TSOT, Tape and Reel; ComponentLink1Description: Manufacturer URL; PackageVersion: 2011; ComponentLink2Description: Datasheet; PackageDescription: 5-Pin SOT-23 Package, 2.9 x 1.6 mm Body, 0.95 mm Pitch, 2.8 mm Lead Span; ComponentLink1URL: http://www.st.com; PackageReference: TSOT23-5L; ComponentLink2URL: http://www.st.com/internet/com/TECHNICAL_RESOURCES/TECHNICAL_LITERATURE/DATASHEET/CD00181873.pdf; DatasheetVersion: Jun-2011
U9 = PM-REG-ST1S10-IL9: Monolithic synchronous step-down regulator, 8-Pin HSOP, Tape and Reel; ComponentLink2Description: Datasheet; PackageDescription: 8-Pin Small Outline Integrated Circuit 1.27 mm Pitch; ComponentLink2URL: http://www.st.com/internet/com/TECHNICAL_RESOURCES/TECHNICAL_LITERATURE/DATASHEET/CD00169322.pdf; ComponentLink1Description: Manufacturer URL; PackageVersion: 2007; DatasheetVersion: Mar-2011; PackageReference: HSO-8; ComponentLink1URL: http://www.st.com